# EAGLE design v1.0 (EAGLE 9.2.1)

## Sheet 1 of 8: Switch State and Buttons
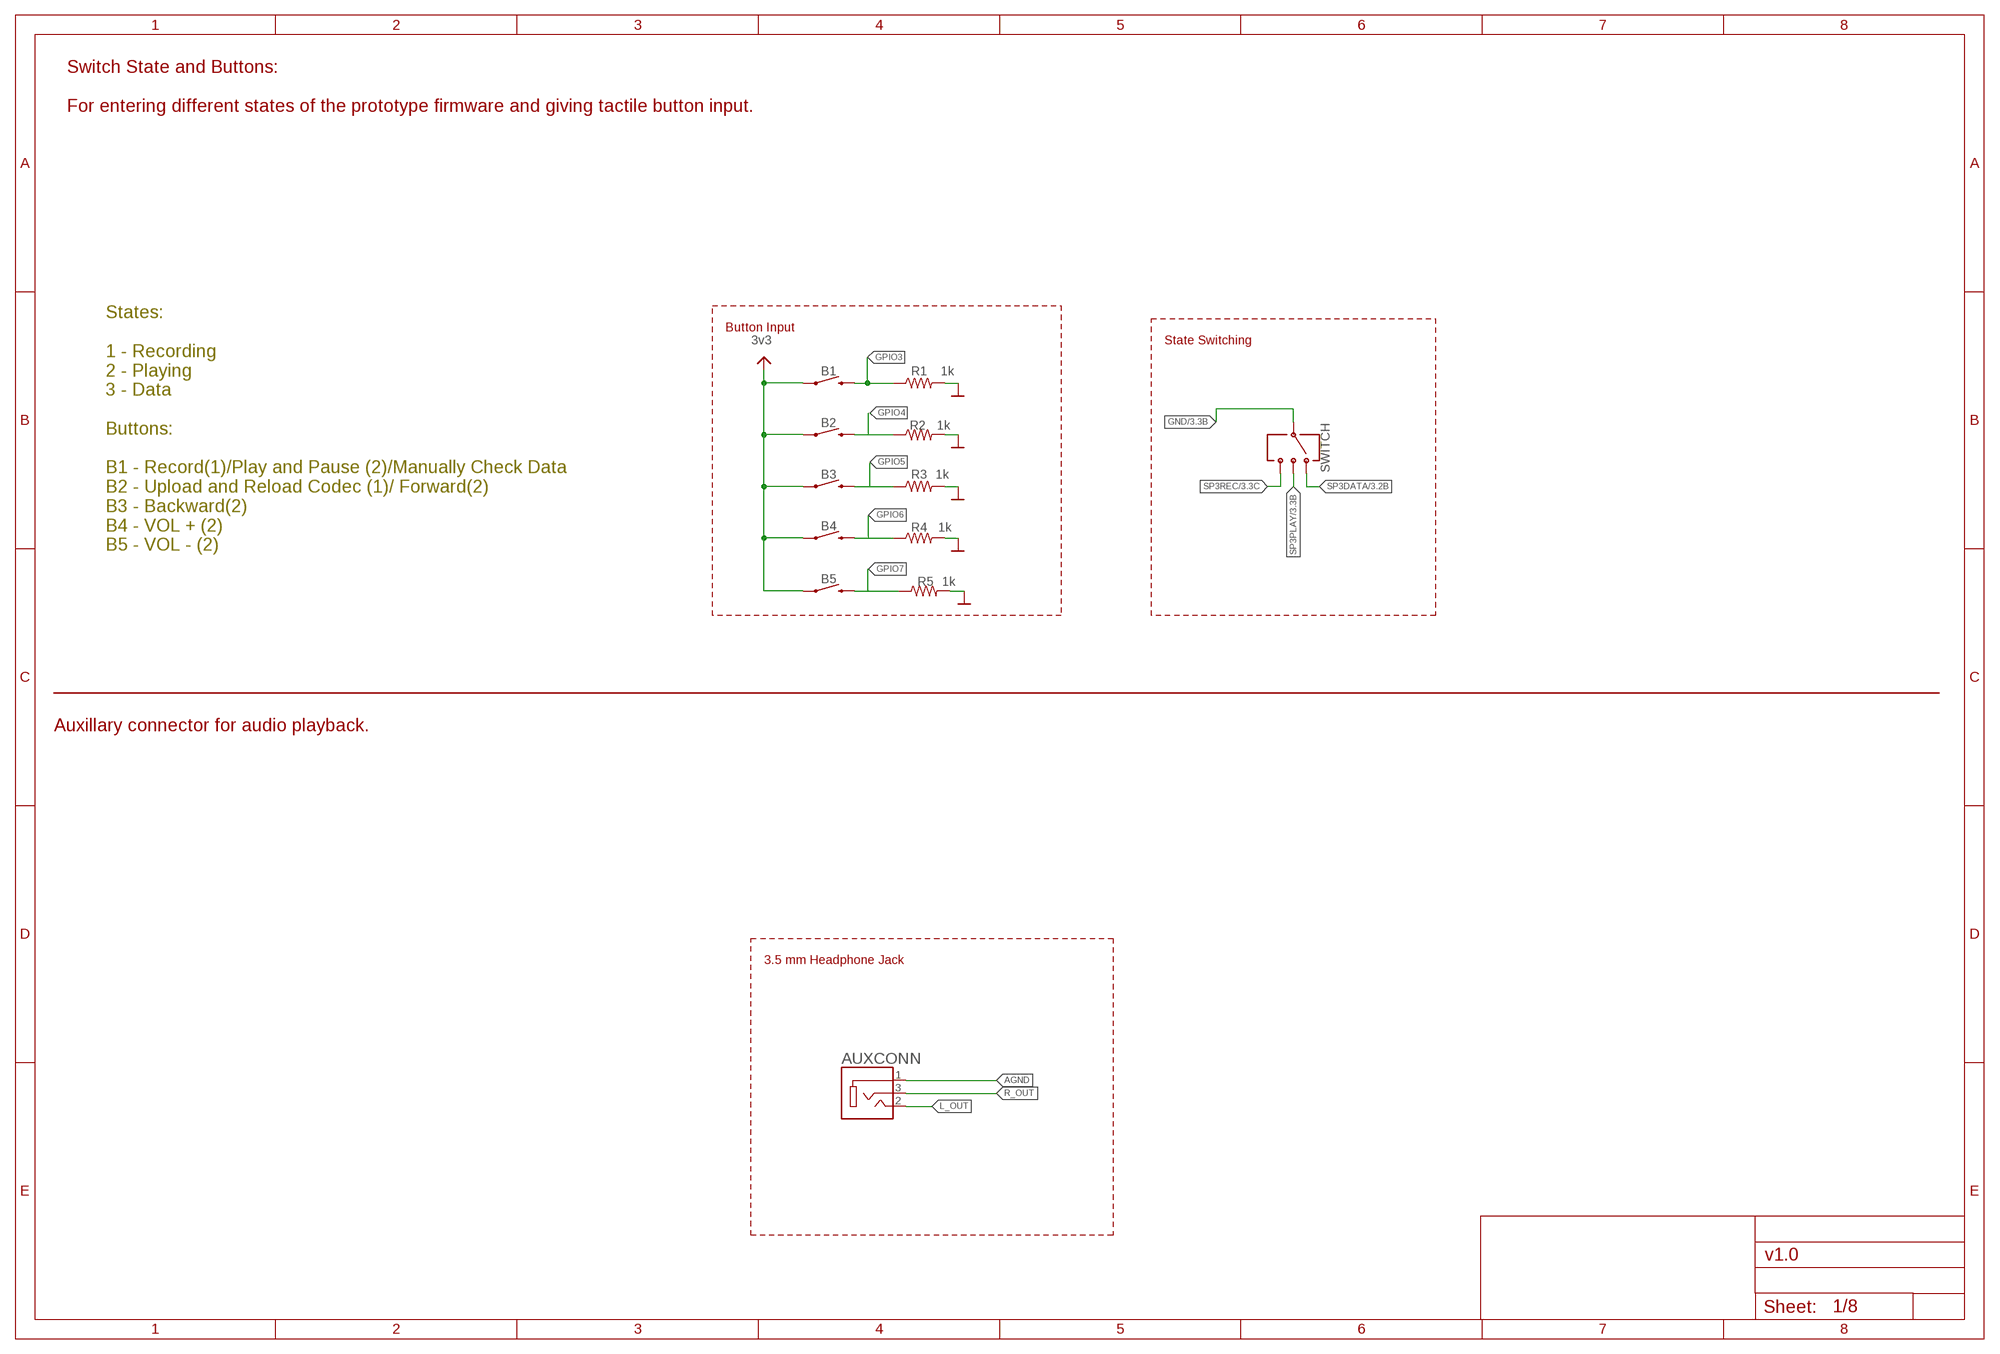
[diagram p0: schematic, sheet 1]

### Parts
AUXCONN  3.5MM_AUX_JACK  [!_SJ-3523-SMT-TR_CUI_SJ-3523-SMT-TR]
B1  MOMENTARY-SWITCH-SPST-SMD-6.2MM-TALL  [!_TACTILE_SWITCH_SMD_6.2MM_TALL]
B2  MOMENTARY-SWITCH-SPST-SMD-6.2MM-TALL  [!_TACTILE_SWITCH_SMD_6.2MM_TALL]
B3  MOMENTARY-SWITCH-SPST-SMD-6.2MM-TALL  [!_TACTILE_SWITCH_SMD_6.2MM_TALL]
B4  MOMENTARY-SWITCH-SPST-SMD-6.2MM-TALL  [!_TACTILE_SWITCH_SMD_6.2MM_TALL]
B5  MOMENTARY-SWITCH-SPST-SMD-6.2MM-TALL  [!_TACTILE_SWITCH_SMD_6.2MM_TALL]
R1  1k  RESISTOR0603  [!_0603]
R2  1k  RESISTOR0603  [!_0603]
R3  1k  RESISTOR0603  [!_0603]
R4  1k  RESISTOR0603  [!_0603]
R5  1k  RESISTOR0603  [!_0603]
SWITCH  SWITCH-SP3T-SMD  [!SWITCH_SP3T_SMD]

### Nets
3.3V: B1.A2 B2.A2 B3.A2 B4.A2 B5.A2 ; supply symbol labelled MICROBUILDER_3.3V ; also sheet 2,3,5,6,7,8
AGND: AUXCONN.1 ; also sheet 2
GND: R1.2 R2.2 R3.2 R4.2 R5.2 SWITCH.3 ; supply symbol labelled MICROBUILDER_GND ; also sheet 2,3,4,5,7,8
GPIO3: B1.B2 R1.1 ; also sheet 2
GPIO4: B2.B2 R2.1 ; also sheet 2
GPIO5: B3.B2 R3.1 ; also sheet 2
GPIO6: B4.B2 R4.1 ; also sheet 2
GPIO7: B5.B2 R5.1 ; also sheet 2
L_OUT: AUXCONN.2 ; also sheet 2
R_OUT: AUXCONN.3 ; also sheet 2
SP3DATA: SWITCH.1 ; also sheet 3
SP3PLAY: SWITCH.2 ; also sheet 3
SP3REC: SWITCH.4 ; also sheet 3

### Notes on the sheet
- Switch State and Buttons: 
  
  For entering different states of the prototype firmware and giving tactile button input.
- Button Input
- 3v3 | State Switching
- States:
  
  1 - Recording
  2 - Playing
  3 - Data
  
  Buttons:
  
  B1 - Record(1)/Play and Pause (2)/Manually Check Data
  B2 - Upload and Reload Codec (1)/ Forward(2)
  B3 - Backward(2)
  B4 - VOL + (2)
  B5 - VOL - (2)
- Auxillary connector for audio playback.
- 3.5 mm Headphone Jack

## Sheet 2 of 8: VS1053 Breakout
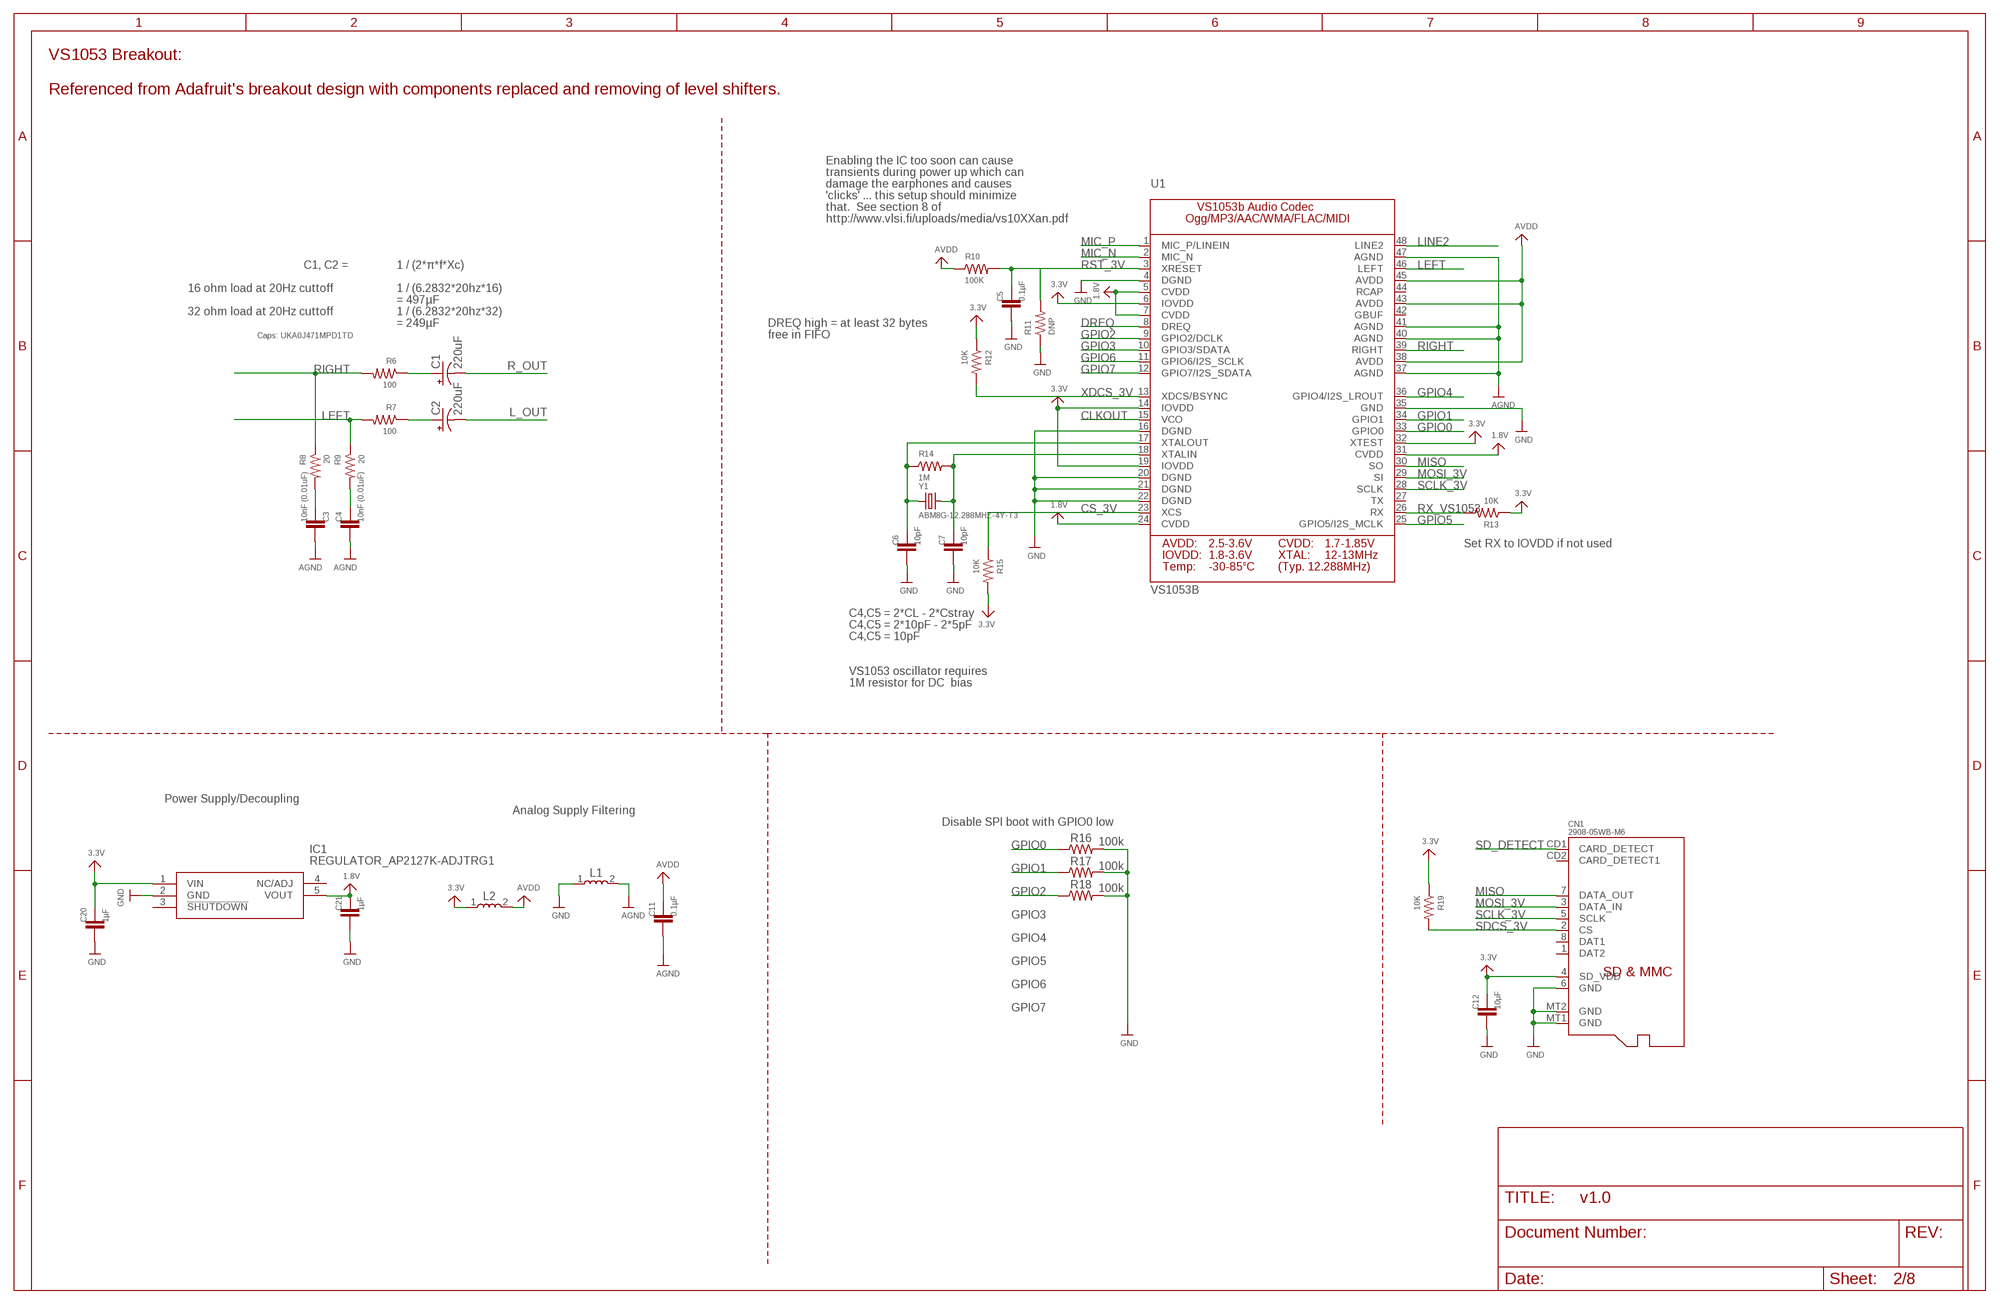
[diagram p1: schematic, sheet 2]

### Parts
C1  220uF  PANASONIC_CAPACITORE  [!_PANASONIC_E]
C2  220uF  PANASONIC_CAPACITORE  [!_PANASONIC_E]
C3  10nF (0.01uF)  CAPACITOR0603  [!_0603]
C4  10nF (0.01uF)  CAPACITOR0603  [!_0603]
C5  0.1µF  CAPACITOR0603  [!_0603]
C6  10pF  CAPACITOR0603  [!_0603]
C7  10pF  CAPACITOR0603  [!_0603]
C11  0.1µF  CAPACITOR0603  [!_0603]
C12  10µF  CAPACITOR0603  [!_0603]
C20  1µF  CAPACITOR0603  [!_0603]
C21  1µF  CAPACITOR0603  [!_0603]
CN1  2908-05WB-M6  MICROSD_SPI  [!_MICROSD]
IC1  REGULATOR_AP2127K-ADJTRG1  [!_AP2127K-ADJTRG1_SOT95P282X145-5N]
L1  FERRITE_BEAD0805  [!_FERRITE_0805]
L2  FERRITE_BEAD0805  [!_FERRITE_0805]
R6  100  RESISTOR0603  [!_0603]
R7  100  RESISTOR0603  [!_0603]
R8  20  RESISTOR0603  [!_0603]
R9  20  RESISTOR0603  [!_0603]
R10  100K  RESISTOR0603  [!_0603]
R11  DNP  RESISTOR0603  [!_0603]
R12  10K  RESISTOR0603  [!_0603]
R13  10K  RESISTOR0603  [!_0603]
R14  1M  RESISTOR0603  [!_0603]
R15  10K  RESISTOR0603  [!_0603]
R16  100k  RESISTOR0603  [!_0603]
R17  100k  RESISTOR0603  [!_0603]
R18  100k  RESISTOR0603  [!_0603]
R19  10K  RESISTOR0603  [!_0603]
U1  VS1053B  [!VS1053_LQFP48]
Y1  ABM8G-12.288MHZ-4Y-T3  MEMS_SMT_CRYSTAL3.2X2.5  [!_CRYSTAL_3.2X2.5]

### Nets
1.8V: C21.1 IC1.5(VOUT) U1.5(CVDD) U1.7(CVDD) U1.24(CVDD) U1.31(CVDD)
3.3V: C12.1 C20.1 CN1.4(SD_VDD) IC1.1(VIN) L2.1 R12.1 R13.1 R15.2 R19.1 U1.6(IOVDD) U1.14(IOVDD) U1.19(IOVDD) U1.32(XTEST) ; also sheet 1,3,5,6,7,8
AGND: C3.2 C4.2 C11.2 L1.2 U1.37(AGND) U1.40(AGND) U1.41(AGND) U1.47(AGND) ; also sheet 1
AVDD: C11.1 L2.2 R10.1 U1.38(AVDD) U1.43(AVDD) U1.45(AVDD)
CLKOUT: U1.15(VCO)
CS_3V: R15.1 U1.23(XCS) ; also sheet 3
DREQ: U1.8(DREQ) ; also sheet 3
GND: C5.2 C6.2 C7.2 C12.2 C20.2 C21.2 CN1.6(GND) CN1.MT1(GND) CN1.MT2(GND) IC1.2(GND) L1.1 R11.1 R16.2 R17.2 R18.2 U1.4(DGND) U1.16(DGND) U1.20(DGND) U1.21(DGND) U1.22(DGND) U1.35(GND) ; also sheet 1,3,4,5,7,8
GPIO0: R16.1 U1.33(GPIO0)
GPIO1: R17.1 U1.34(GPIO1)
GPIO2: R18.1 U1.9(GPIO2/DCLK)
GPIO3: U1.10(GPIO3/SDATA) ; also sheet 1
GPIO4: U1.36(GPIO4/I2S_LROUT) ; also sheet 1
GPIO5: U1.25(GPIO5/I2S_MCLK) ; also sheet 1
GPIO6: U1.11(GPIO6/I2S_SCLK) ; also sheet 1
GPIO7: U1.12(GPIO7/I2S_SDATA) ; also sheet 1
L_OUT: C2.- ; also sheet 1
LEFT: R7.2 R9.1 U1.46(LEFT)
LEFT_FILTERED: C2.+ R7.1
LINE2: U1.48(LINE2)
MIC_N: U1.2(MIC_N)
MIC_P: U1.1(MIC_P/LINEIN) ; also sheet 7
MISO: CN1.7(DATA_OUT) U1.30(SO) ; also sheet 3,5
MOSI_3V: CN1.3(DATA_IN) U1.29(SI) ; also sheet 3,5
N$1: C6.1 R14.1 U1.17(XTALOUT) Y1.1
N$2: C7.1 R14.2 U1.18(XTALIN) Y1.2
N$5: C4.1 R9.2
N$6: C3.1 R8.2
R_OUT: C1.- ; also sheet 1
RIGHT: R6.2 R8.1 U1.39(RIGHT)
RIGHT_FILTERED: C1.+ R6.1
RST_3V: C5.1 R10.2 R11.2 U1.3(XRESET) ; also sheet 3
RX_VS1053: R13.2 U1.26(RX)
SCLK_3V: CN1.5(SCLK) U1.28(SCLK) ; also sheet 3,5
SD_DETECT: CN1.CD1(CARD_DETECT)
SDCS_3V: CN1.2(CS) R19.2 ; also sheet 3
XDCS_3V: R12.2 U1.13(XDCS/BSYNC) ; also sheet 3
Unconnected: CN1.1(DAT2) CN1.8(DAT1) CN1.CD2(CARD_DETECT1) IC1.3(!SHUTDOWN) IC1.4(NC/ADJ) U1.27(TX) U1.42(GBUF) U1.44(RCAP)

### Notes on the sheet
- VS1053 Breakout:
  
  Referenced from Adafruit's breakout design with components replaced and removing of level shifters.
- Enabling the IC too soon can cause
- transients during power up which can
- damage the earphones and causes
- 'clicks' ... this setup should minimize
- that.  See section 8 of
- http://www.vlsi.fi/uploads/media/vs10XXan.pdf
- C1, C2 = | 1 / (2*π*f*Xc)
- 16 ohm load at 20Hz cuttoff | 1 / (6.2832*20hz*16)
- = 497µF
- 32 ohm load at 20Hz cuttoff | 1 / (6.2832*20hz*32)
- = 249µF | DREQ high = at least 32 bytes
- Caps: UKA0J471MPD1TD | free in FIFO
- Set RX to IOVDD if not used
- C4,C5 = 2*CL - 2*Cstray
- C4,C5 = 2*10pF - 2*5pF
- C4,C5 = 10pF
- VS1053 oscillator requires
- 1M resistor for DC  bias
- Power Supply/Decoupling
- Analog Supply Filtering
- Disable SPI boot with GPIO0 low

## Sheet 3 of 8: Photon Breakout
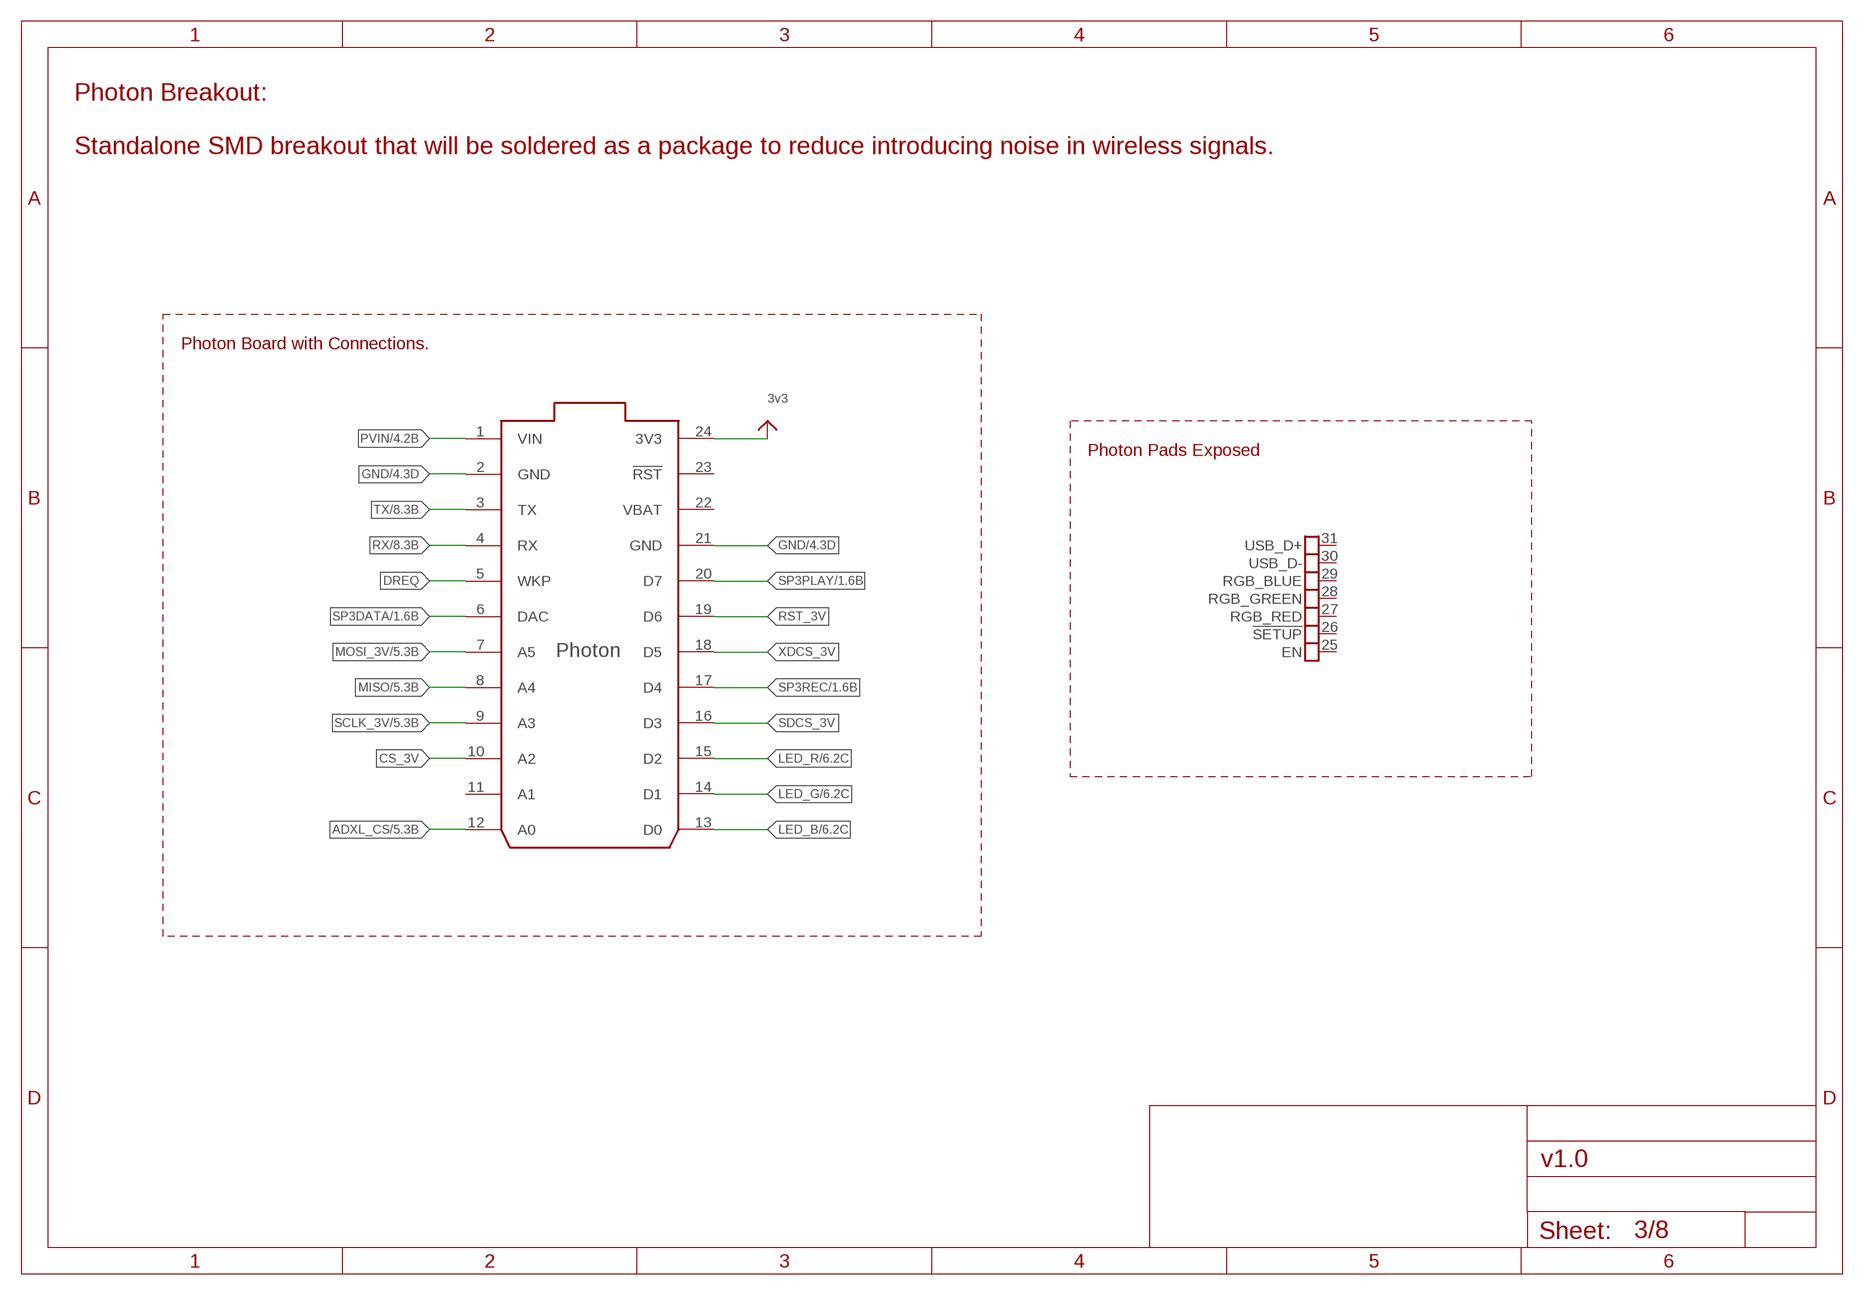
[diagram p2: schematic, sheet 3]

### Parts
U$1  PARTICLE-DEVICES_PHOTON_SMD  [!_PARTICLE-DEVICES_PHOTON_SMD]

### Nets
3.3V: U$1.24(3V3) ; supply symbol labelled MICROBUILDER_3.3V ; also sheet 1,2,5,6,7,8
ADXL_CS: U$1.12(A0) ; also sheet 5
CS_3V: U$1.10(A2) ; also sheet 2
DREQ: U$1.5(WKP) ; also sheet 2
GND: U$1.2(GND) U$1.21(GND) ; also sheet 1,2,4,5,7,8
LED_B: U$1.13(D0) ; also sheet 6
LED_G: U$1.14(D1) ; also sheet 6
LED_R: U$1.15(D2) ; also sheet 6
MISO: U$1.8(A4) ; also sheet 2,5
MOSI_3V: U$1.7(A5) ; also sheet 2,5
PVIN: U$1.1(VIN) ; also sheet 4
RST_3V: U$1.19(D6) ; also sheet 2
RX: U$1.4(RX) ; also sheet 8
SCLK_3V: U$1.9(A3) ; also sheet 2,5
SDCS_3V: U$1.16(D3) ; also sheet 2
SP3DATA: U$1.6(DAC) ; also sheet 1
SP3PLAY: U$1.20(D7) ; also sheet 1
SP3REC: U$1.17(D4) ; also sheet 1
TX: U$1.3(TX) ; also sheet 8
XDCS_3V: U$1.18(D5) ; also sheet 2
Unconnected: U$1.11(A1) U$1.23(!RST) U$1.25(EN) U$1.26(!SETUP) U$1.27(RGB_RED) U$1.28(RGB_GREEN) U$1.29(RGB_BLUE) U$1.30(USB_D-) U$1.31(USB_D+)

### Notes on the sheet
- Photon Breakout:
  
  Standalone SMD breakout that will be soldered as a package to reduce introducing noise in wireless signals.
- Photon Board with Connections.
- 3v3
- Photon Pads Exposed

## Sheet 4 of 8: Power Management
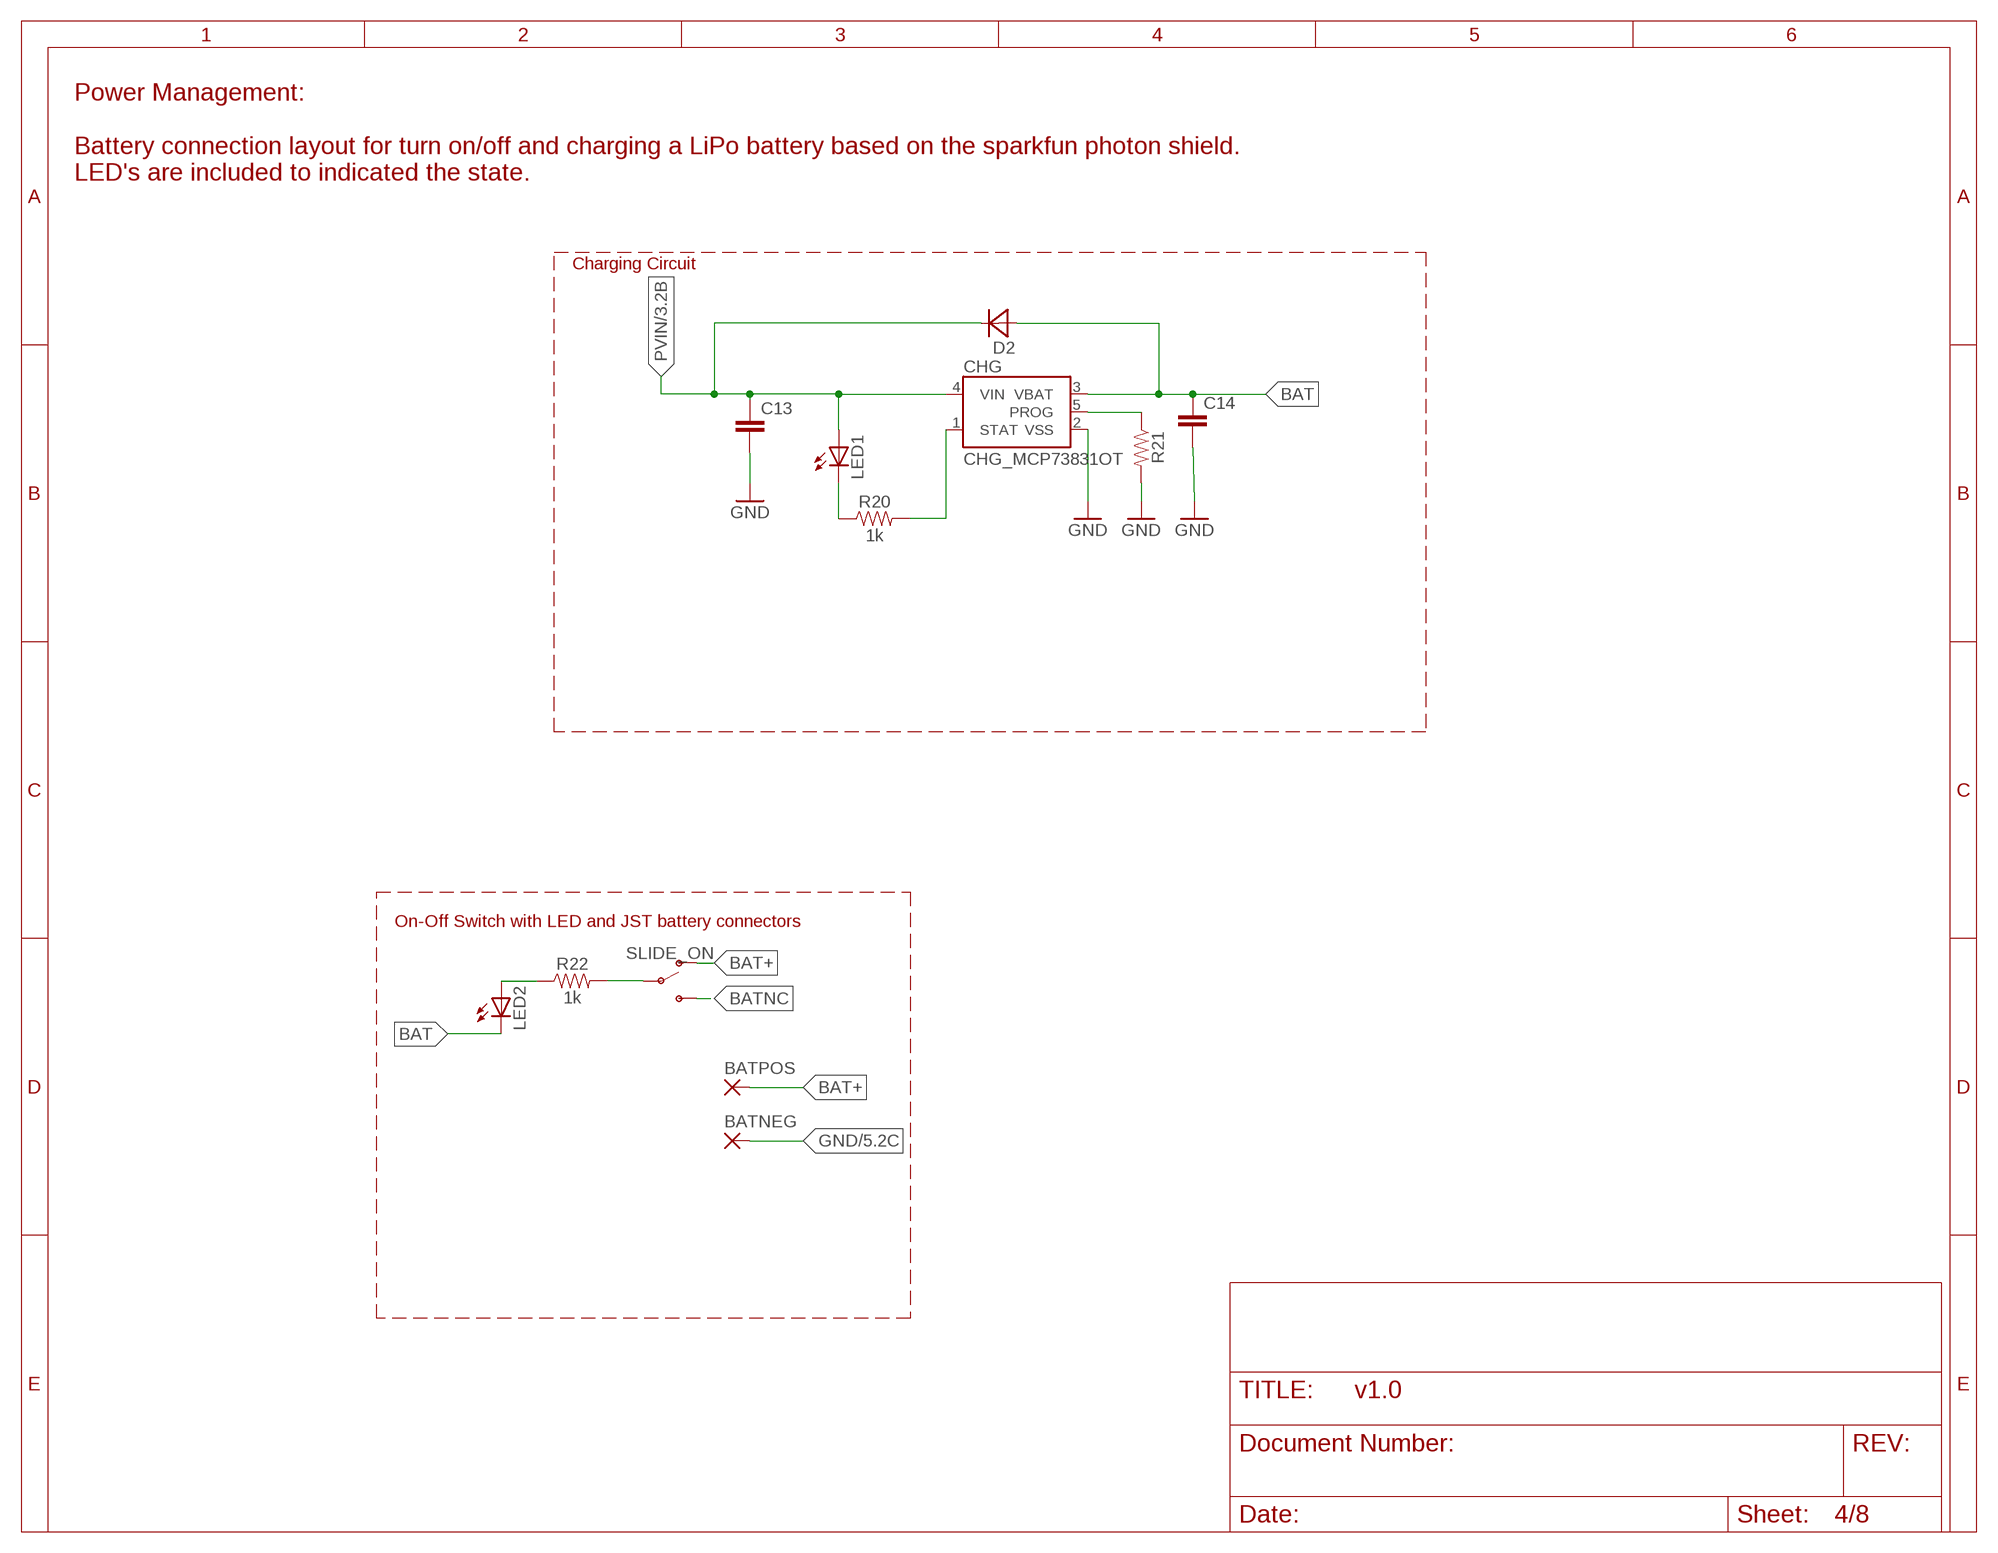
[diagram p3: schematic, sheet 4]

### Parts
BATNEG  SMD5  [SMD2,54-5,08]
BATPOS  SMD5  [SMD2,54-5,08]
C13  4.7uF  CAPACITOR0603  [!_0603]
C14  4.7uF  CAPACITOR0603  [!_0603]
CHG  CHG_MCP73831OT  [!_SOT23-5]
D2  DIODE_MBRA140T3  [!_DIODE_SMA]
LED1  PASSIVE_LED  [!_LED_0603]
LED2  PASSIVE_LED  [!_LED_0603]
R20  1k  RESISTOR0603  [!_0603]
R21  10k  RESISTOR0603  [!_0603]
R22  1k  RESISTOR0603  [!_0603]
SLIDE_ON  PASSIVE_SLIDE_SWITCHES  [!_SWITCH_PCM12SMTR]

### Nets
BAT: C14.1 CHG.3(VBAT) D2.A LED2.C
BAT+: BATPOS.1(P) SLIDE_ON.O
BATNC: SLIDE_ON.S
GND: BATNEG.1(P) C13.2 C14.2 CHG.2(VSS) R21.2 ; also sheet 1,2,3,5,7,8
N$3: CHG.1(STAT) R20.2
N$4: LED1.C R20.1
N$8: R22.2 SLIDE_ON.P
N$9: LED2.A R22.1
N$21: CHG.5(PROG) R21.1
PVIN: C13.1 CHG.4(VIN) D2.C LED1.A ; also sheet 3

### Notes on the sheet
- Power Management:
  
  Battery connection layout for turn on/off and charging a LiPo battery based on the sparkfun photon shield. 
  LED's are included to indicated the state.
- Charging Circuit
- On-Off Switch with LED and JST battery connectors

## Sheet 5 of 8: Accelerometer ADXL335
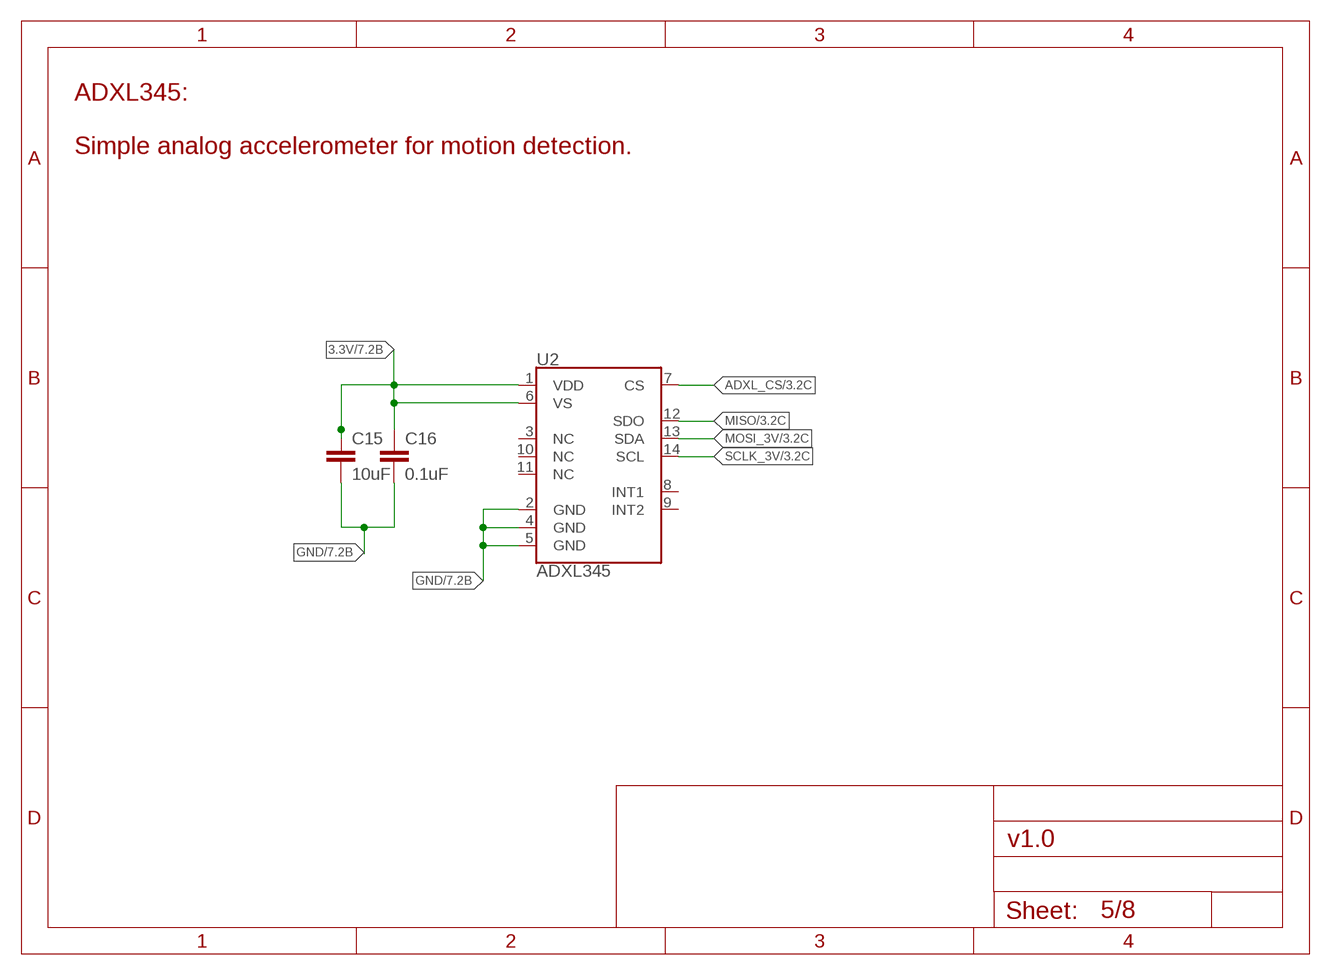
[diagram p4: schematic, sheet 5]

### Parts
C15  10uF  CAPACITOR0603  [!_0603]
C16  0.1uF  CAPACITOR0603  [!_0603]
U2  ADXL345  [!_ADXL345_LGA-14]

### Nets
3.3V: C15.1 C16.1 U2.1(VDD) U2.6(VS) ; also sheet 1,2,3,6,7,8
ADXL_CS: U2.7(CS) ; also sheet 3
GND: C15.2 C16.2 U2.2(GND) U2.4(GND) U2.5(GND) ; also sheet 1,2,3,4,7,8
MISO: U2.12(SDO) ; also sheet 2,3
MOSI_3V: U2.13(SDA) ; also sheet 2,3
SCLK_3V: U2.14(SCL) ; also sheet 2,3
Unconnected: U2.3(NC) U2.8(INT1) U2.9(INT2) U2.10(NC) U2.11(NC)

### Notes on the sheet
- ADXL345:
  
  Simple analog accelerometer for motion detection.

## Sheet 6 of 8: Tricolour-LED
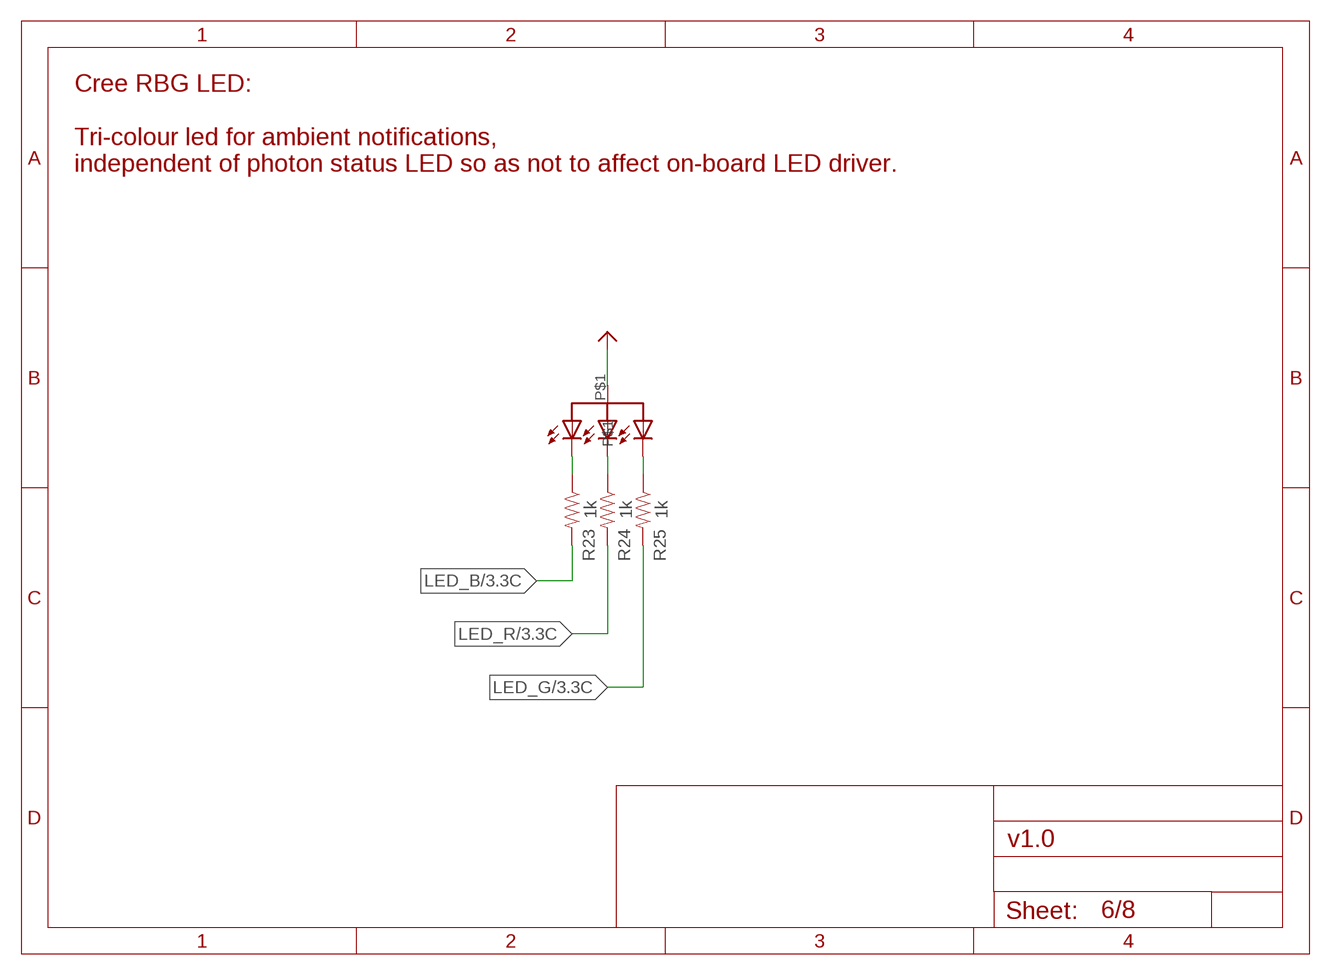
[diagram p5: schematic, sheet 6]

### Parts
LED3  LED_TRICOLOR_3.2X2.8  [!_LED_3.2X2.8]
R23  1k  RESISTOR0603  [!_0603]
R24  1k  RESISTOR0603  [!_0603]
R25  1k  RESISTOR0603  [!_0603]

### Nets
3.3V: LED3.P$1 ; supply symbol labelled MICROBUILDER_3.3V ; also sheet 1,2,3,5,7,8
LED_B: R23.2 ; also sheet 3
LED_G: R25.2 ; also sheet 3
LED_R: R24.2 ; also sheet 3
N$11: LED3.P$2 R23.1
N$12: LED3.P$3 R24.1
N$13: LED3.P$4 R25.1

### Notes on the sheet
- Cree RBG LED:
  
  Tri-colour led for ambient notifications, 
  independent of photon status LED so as not to affect on-board LED driver.

## Sheet 7 of 8: Microphone Breakout
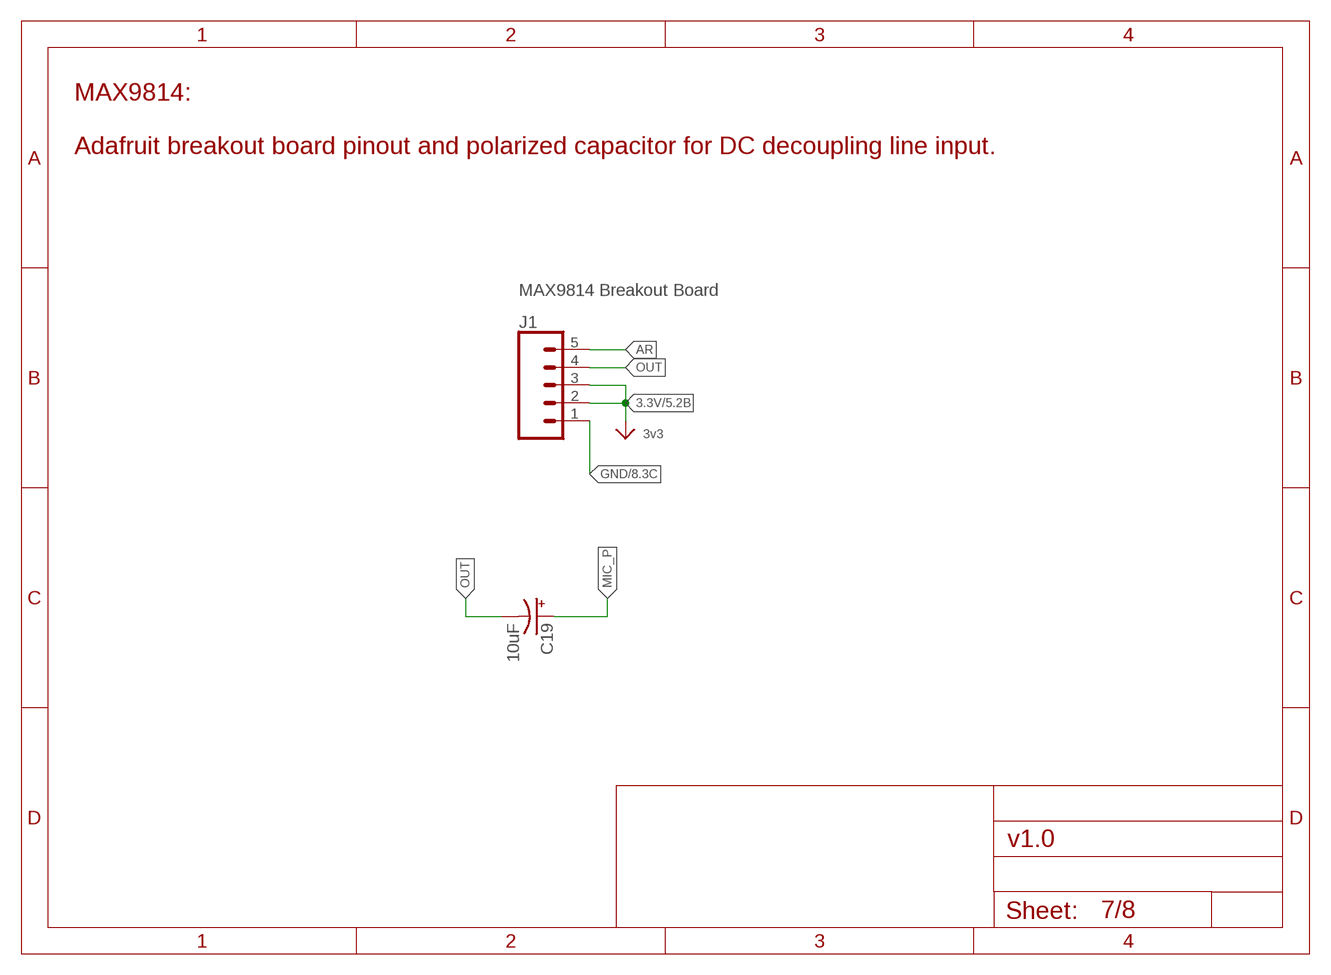
[diagram p6: schematic, sheet 7]

### Parts
C19  10uF  PARTICLE_TANT-CAP0603  [!_PARTICLE_PC0603]
J1  CONNECTORS_CONN_05  [!_CONNECTORS_1X05]

### Nets
3.3V: J1.2 J1.3 ; supply symbol labelled MICROBUILDER_3.3V ; also sheet 1,2,3,5,6,8
AR: J1.5
GND: J1.1 ; also sheet 1,2,3,4,5,8
MIC_P: C19.A(+) ; also sheet 2
OUT: C19.C(-) J1.4

### Notes on the sheet
- MAX9814:
  
  Adafruit breakout board pinout and polarized capacitor for DC decoupling line input.
- MAX9814 Breakout Board
- 3v3

## Sheet 8 of 8: GPS Breakout
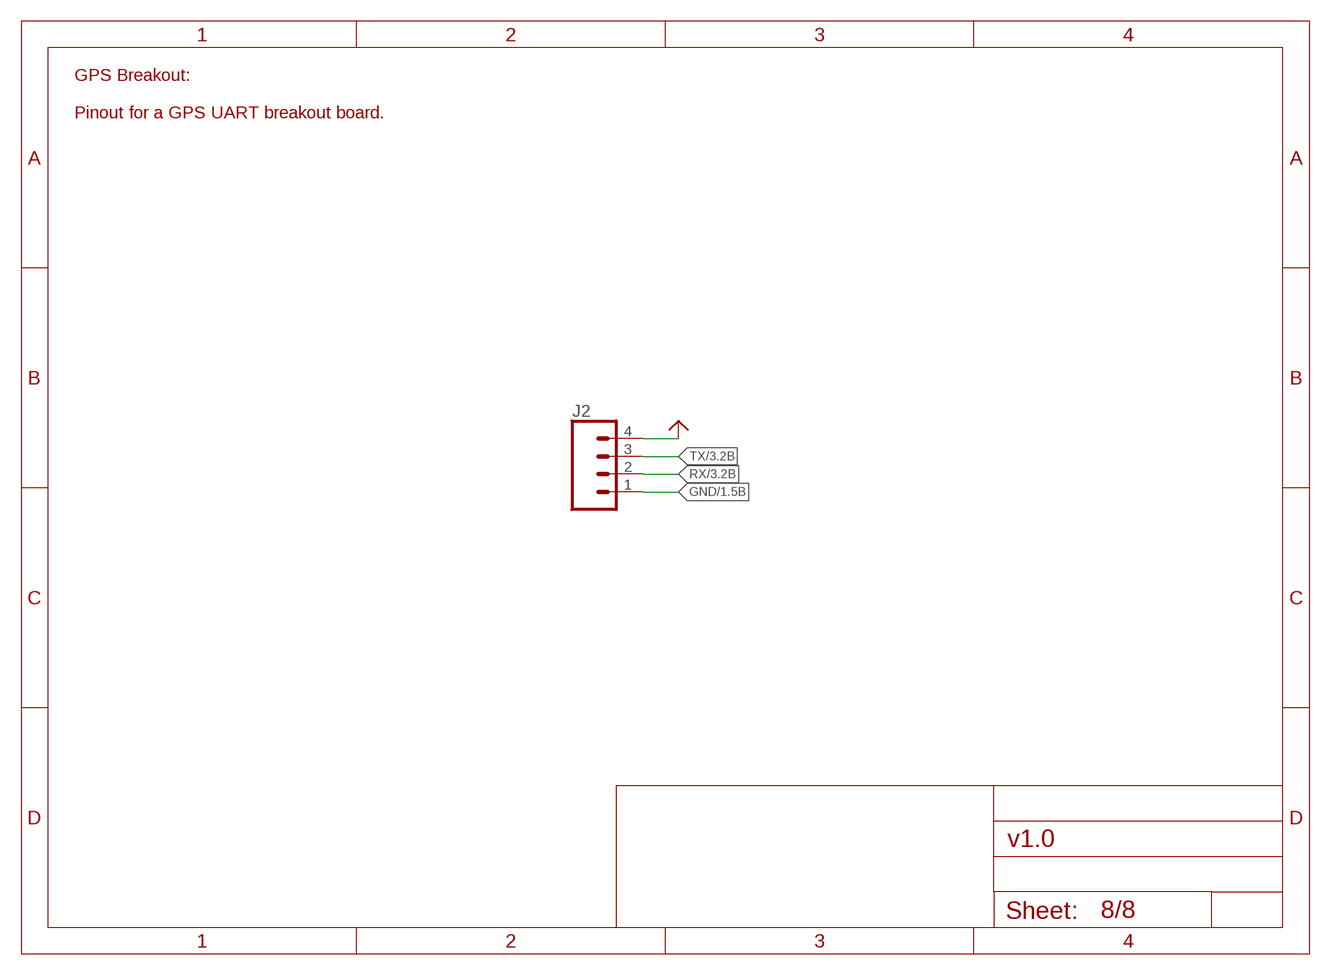
[diagram p7: schematic, sheet 8]

### Parts
J2  CONNECTORS_CONN_04  [!_CONNECTORS_1X04]

### Nets
3.3V: J2.4 ; supply symbol labelled MICROBUILDER_3.3V ; also sheet 1,2,3,5,6,7
GND: J2.1 ; also sheet 1,2,3,4,5,7
RX: J2.2 ; also sheet 3
TX: J2.3 ; also sheet 3

### Notes on the sheet
- GPS Breakout:
  
  Pinout for a GPS UART breakout board.

## Power pins joined to a net without a drawn wire
VBAT: U$1.22(VBAT)

## Library data of the parts
AUXCONN = clab_v1.0:3.5MM_AUX_JACK: Audio Jack Connector 3.5 mm Low Profile Surface Mount Stereo Jack, 3 Pin Right-Angle; AVAILABILITY: Unavailable; CUI_PURCHASE_URL: https://www.cui.com/product/interconnect/audio-connectors/3.5-mm-jacks/sj-352x-smt-series?utm_source=snapeda.com&utm_medium=referral&utm_campaign=snapedaBOM; DESCRIPTION: SJ Series 3.5 mm 12 V SMT Right Angle Stereo Audio Jack; MF: CUI Inc.; MP: SJ-3523-SMT-TR; PACKAGE: LGA-10 STMicroelectronics; PRICE: None
B1-B5 = clab_v1.0:MOMENTARY-SWITCH-SPST: Momentary Switch (Pushbutton) - SPST Normally-open (NO) SPST momentary switches (buttons, pushbuttons). Variants PTH-12MM - 12mm square, through-hole Momentary Pushbutton Switch - 12mm Square <https://www.sparkfun.com/products/9190> (COM-09190) PTH-6.0MM, PTH-6.0MM-KIT - 6.0mm square, through-hole Mini Pushbutton Switch <https://www.sparkfun.com/products/97> (COM-00097) KIT package intended for soldering kit's - only one side of pads' copper is exposed. PTH-RIGHT-ANGLE-KIT - Right-angle, through-hole Right Angle Tactile Button <https://www.sparkfun.com/products/10791> - Used on SparkFun BigTime Watch Kit <https://www.sparkfun.com/products/11734> SMD-12MM - 12mm square, surface-mount Tactile Button - SMD (12mm) <https://www.sparkfun.com/products/12993> (COM-12993) Used on SparkFun PicoBoard <https://www.sparkfun.com/products/11888> SMD-4.5MM - 4.5mm Square Trackball Switch Used on SparkFun Blackberry Trackballer Breakout <https://www.sparkfun.com/products/13169> SMD-4.6MMX2.8MM - 4.60mm x 2.80mm, surface mount Used on SparkFun SAMD21 Mini Breakout <https://www.sparkfun.com/products/13664> SMD-5.2MM, SMD-5.2-REDUNDANT - 5.2mm square, surface-mount Mini Pushbutton Switch - SMD <https://www.sparkfun.com/products/8720> (COM-08720) Used on Arduino Pro Mini <https://www.sparkfun.com/products/11114> REDUNDANT package connects both switch circuits together SMD-6.0X3.5MM - 6.0 x 3.5mm, surface mount Momentary Reset Switch SMD <https://www.sparkfun.com/products/8229> (COM-08229) SMD-6.2MM-TALL - 6.2mm square, surface mount Tactile Button - SMD (6mm) <https://www.sparkfun.com/products/12992> Used on SparkFun Digital Sandbox <https://www.sparkfun.com/products/12651> SMD-RIGHT-ANGLE - Right-angle, surface mount Used on SparkFun Block for Intel® Edison - Arduino <https://www.sparkfun.com/products/13036>; PROD_ID: SWCH-11966; SF_SKU: COM-12992
BATNEG BATPOS = wirepad:SMD5: SMD PAD
C1 C2 = clab_v1.0:PANASONIC_CAPACITOR: POLARIZED CAPACITOR, American symbol; SPICEPREFIX: C
C3-C7 C11-C16 C20 C21 = clab_v1.0:CAPACITOR
C19 = clab_v1.0:PARTICLE_TANT-CAP: Tantalum SMT
CHG = clab_v1.0:CHG_MCP73831; DIGIKEY: MCP73831T-2ATI/OTCT-ND
CN1 = clab_v1.0:MICROSD_SPI: MicroSD/Transflash Card Holder with SPI pinout 3M: 2908-05WB-MG 4UConnector: 19656 Footprint courtesy: Adafruit Industries
D2 = clab_v1.0:DIODE_MBRA140T3: Surface Mount Schottky Power Rectifier Source: http://www.onsemi.com/pub_link/Collateral/MBRA340T3-D.PDF
IC1 = clab_v1.0:REGULATOR_AP2127K-ADJTRG1: DiodesZetex AP2127K-ADJTRG1, Low Noise LDO Voltage Regulator, Adjustable 0.8 5.5 V +/-2%, 5-Pin SOT-23 Source: Datasheet <https://www.diodes.com/assets/Datasheets/AP2127.pdf>; ALLIED_NUMBER: 70550999; ALLIED_PRICE-STOCK: https://www.alliedelec.com/diodesinc-ap2127k-adjtrg1/70550999/; DESCRIPTION: DiodesZetex AP2127K-ADJTRG1, Low Noise LDO Voltage Regulator, Adjustable 0.8 5.5 V +/-2%, 5-Pin SOT-23; HEIGHT: 1.45mm; MANUFACTURER_NAME: Diodes Inc.; MANUFACTURER_PART_NUMBER: AP2127K-ADJTRG1; MOUSER_PART_NUMBER: 621-AP2127K-ADJTRG1; MOUSER_PRICE-STOCK: https://www.mouser.com/Search/Refine.aspx?Keyword=621-AP2127K-ADJTRG1; RS_PART_NUMBER: 9210382P; RS_PRICE-STOCK: http://uk.rs-online.com/web/p/products/9210382P
J1 = clab_v1.0:CONNECTORS_CONN_05: Multi connection point. Often used as Generic Header-pin footprint for 0.1 inch spaced/style header connections On any of the 0.1 inch spaced packages, you can populate with these: Break Away Headers - Straight <https://www.sparkfun.com/products/116> (PRT-00116) Break Away Male Headers - Right Angle <https://www.sparkfun.com/products/553> (PRT-00553) Female Headers <https://www.sparkfun.com/products/115> (PRT-00115) Break Away Headers - Machine Pin <https://www.sparkfun.com/products/117> (PRT-00117) Break Away Female Headers - Swiss Machine Pin <https://www.sparkfun.com/products/743> (PRT-00743) For SCREWTERMINALS and SPRING TERMINALS visit here: Screw Terimnals on SparkFun.com <https://www.sparkfun.com/search/results?term=Screw+Terminals> (5mm/3.5mm/2.54mm spacing) This device is also useful as a general connection point to wire up your design to another part of your project. Our various solder wires solder well into these plated through hole pads. Hook-Up Wire - Assortment (Stranded, 22 AWG) <https://www.sparkfun.com/products/11375> (PRT-11375) Hook-Up Wire - Assortment (Solid Core, 22 AWG) <https://www.sparkfun.com/products/11367> (PRT-11367) View the entire wire category on our website here <https://www.sparkfun.com/categories/141> Special notes: Molex polarized connector foot print use with SKU : PRT-08231 with associated crimp pins and housings. 1MM SMD Version SKU: PRT-10208
J2 = clab_v1.0:CONNECTORS_CONN_04: Multi connection point. Often used as Generic Header-pin footprint for 0.1 inch spaced/style header connections On any of the 0.1 inch spaced packages, you can populate with these: Break Away Headers - Straight <https://www.sparkfun.com/products/116> (PRT-00116) Break Away Male Headers - Right Angle <https://www.sparkfun.com/products/553> (PRT-00553) Female Headers <https://www.sparkfun.com/products/115> (PRT-00115) Break Away Headers - Machine Pin <https://www.sparkfun.com/products/117> (PRT-00117) Break Away Female Headers - Swiss Machine Pin <https://www.sparkfun.com/products/743> (PRT-00743) For SCREWTERMINALS and SPRING TERMINALS visit here: Screw Terimnals on SparkFun.com <https://www.sparkfun.com/search/results?term=Screw+Terminals> (5mm/3.5mm/2.54mm spacing) This device is also useful as a general connection point to wire up your design to another part of your project. Our various solder wires solder well into these plated through hole pads. Hook-Up Wire - Assortment (Stranded, 22 AWG) <https://www.sparkfun.com/products/11375> (PRT-11375) Hook-Up Wire - Assortment (Solid Core, 22 AWG) <https://www.sparkfun.com/products/11367> (PRT-11367) View the entire wire category on our website here <https://www.sparkfun.com/categories/141> Special notes: Molex polarized connector foot print use with SKU : PRT-08231 with associated crimp pins and housings. 1MM SMD Version SKU: PRT-10208; PROD_ID: CONN-09696
L1 L2 = clab_v1.0:FERRITE_BEAD
LED1 LED2 = clab_v1.0:PASSIVE_LED
LED3 = clab_v1.0:LED_TRICOLOR; DIGIKEY: CLV1L-FKB-CHMMQEHBB7673673CT-ND
R1-R25 = clab_v1.0:RESISTOR
SLIDE_ON = clab_v1.0:PASSIVE_SLIDE_SWITCHES
SWITCH = clab_v1.0:SWITCH-SP3T: Single-Pole, Triple-Throw (SP3T) Switch Single-Pole, Triple-Throw switches SparkFun Products Prototype Part; PROD_ID: SWCH-10805
U1 = clab_v1.0:VS1053B: VS1053b Audio Codec - Ogg Vorbis/MP3/AAC/WMA/FLAC/MIDI
U2 = clab_v1.0:ADXL345: Analog Devices ADXL345 3-Axis SPI/I2C 2/4/8/16g Accelerometer The ADXL345 is a small, thin, low power, 3-axis accelerometer with high resolution (13-bit) measurement at up to ±16g. Digital output data is formatted as 16-bit twos complement and is accessible through either a SPI (3- or 4-wire) or I2C digital interface. Datasheet <https://www.sparkfun.com/datasheets/Sensors/Accelerometer/ADXL345.pdf> SparkFun Products SparkFun Triple Axis Accelerometer Breakout - ADXL345 <https://www.sparkfun.com/products/9836> (SEN-09836) Triple Axis Accelerometer - ADXL345 <https://www.sparkfun.com/products/9045> (SEN-09045) SparkFun 6 Degrees of Freedom IMU Digital Combo Board - ITG3200/ADXL345 <https://www.sparkfun.com/products/10121> (SEN-10121); DESCRIPTION: ADI Digital Output Three-Axis Accel; MF: Analog Devices; MP: ADXL345; PACKAGE: None
U$1 = clab_v1.0:PARTICLE-DEVICES_PHOTON_SMD: Particle Photon (without headers) WiFi development board footprint - designed to be surface mounted with 7 extra exposed pads on the bottom of the board which include, 3 RGB LED outputs, /SETUP, EN (3.3V SMPS enable input), USB D+ and USB D-. Product datasheet: here <https://docs.particle.io/datasheets/photon-(wifi)/photon-datasheet/> Design files: here <https://github.com/particle-iot/photon> Github : Particle devices library <https://github.com/particle-iot/hardware-libraries/tree/master/Eagle>
Y1 = clab_v1.0:MEMS_SMT_CRYSTAL: Crystals HC49UP - Surface Mount Crystal 4.0MHz 18pF +/-30ppm Surface Mount Crystal [Digikey: 535-9857-1-ND] 12.0 MHz Surface Mount Crystal [Digikey: 535-9869-6-ND] 25.0 MHz Surface Mount Crystal [Digikey: 535-9078-1-ND] 2.5 x 2.0mm - MEMs SMT Crystal 16.0 MHz 10pF 20ppm 2.5 x 2.0mm Crystal [Digikey -40-85°C: 535-10923-1-ND] 3.2 x 2.5mm - MEMs SMT Crystal 12.0 MHz 8pF 15ppm 3.2 x 2.5mm Crystal [Digikey: -10-70°C: 644-1047-1-ND -40-125°C: 644-1128-1-ND] 40~85°C cheaper: 644-1173-6-ND 16.0 MHz 8pF 15ppm 3.2 x 2.5mm Crystal [Digikey: -10-70°C: 644-1049-1-ND -40-125°C: 644-1129-2-ND]-40~85°C cheaper: 644-1175-6-ND 16.0 MHz 10pF 10ppm 3.2 x 2.5mm Crystal [Digikey: 644-1100-1-ND] 27.12 MHz 18pF 30ppm 3.2 x 2.5mm Crystal [Digikey: 887-1424-1-ND] 27.12MHz 10pF 10ppm 3.2 x 2.5mm Crystal [Digikey: 887-1329-1-ND] 4.9 x 1.8mm - MEMs SMT Crystal 32.768 KHz 12.5pF 20ppm 4.9 x 1.8mm Crystal [Digikey: SE2415CT-ND] 8.0 x 3.8mm - Surface Mount Crystal 32.768kHz 12.5pF 20ppm -40°C-85°C [Digikey: 535-9166-2-ND] Cylinder 32.768KHz Cylinder Crystal (2x6mm body) [Ex. Digikey: 300-8341-2-ND]

## Board
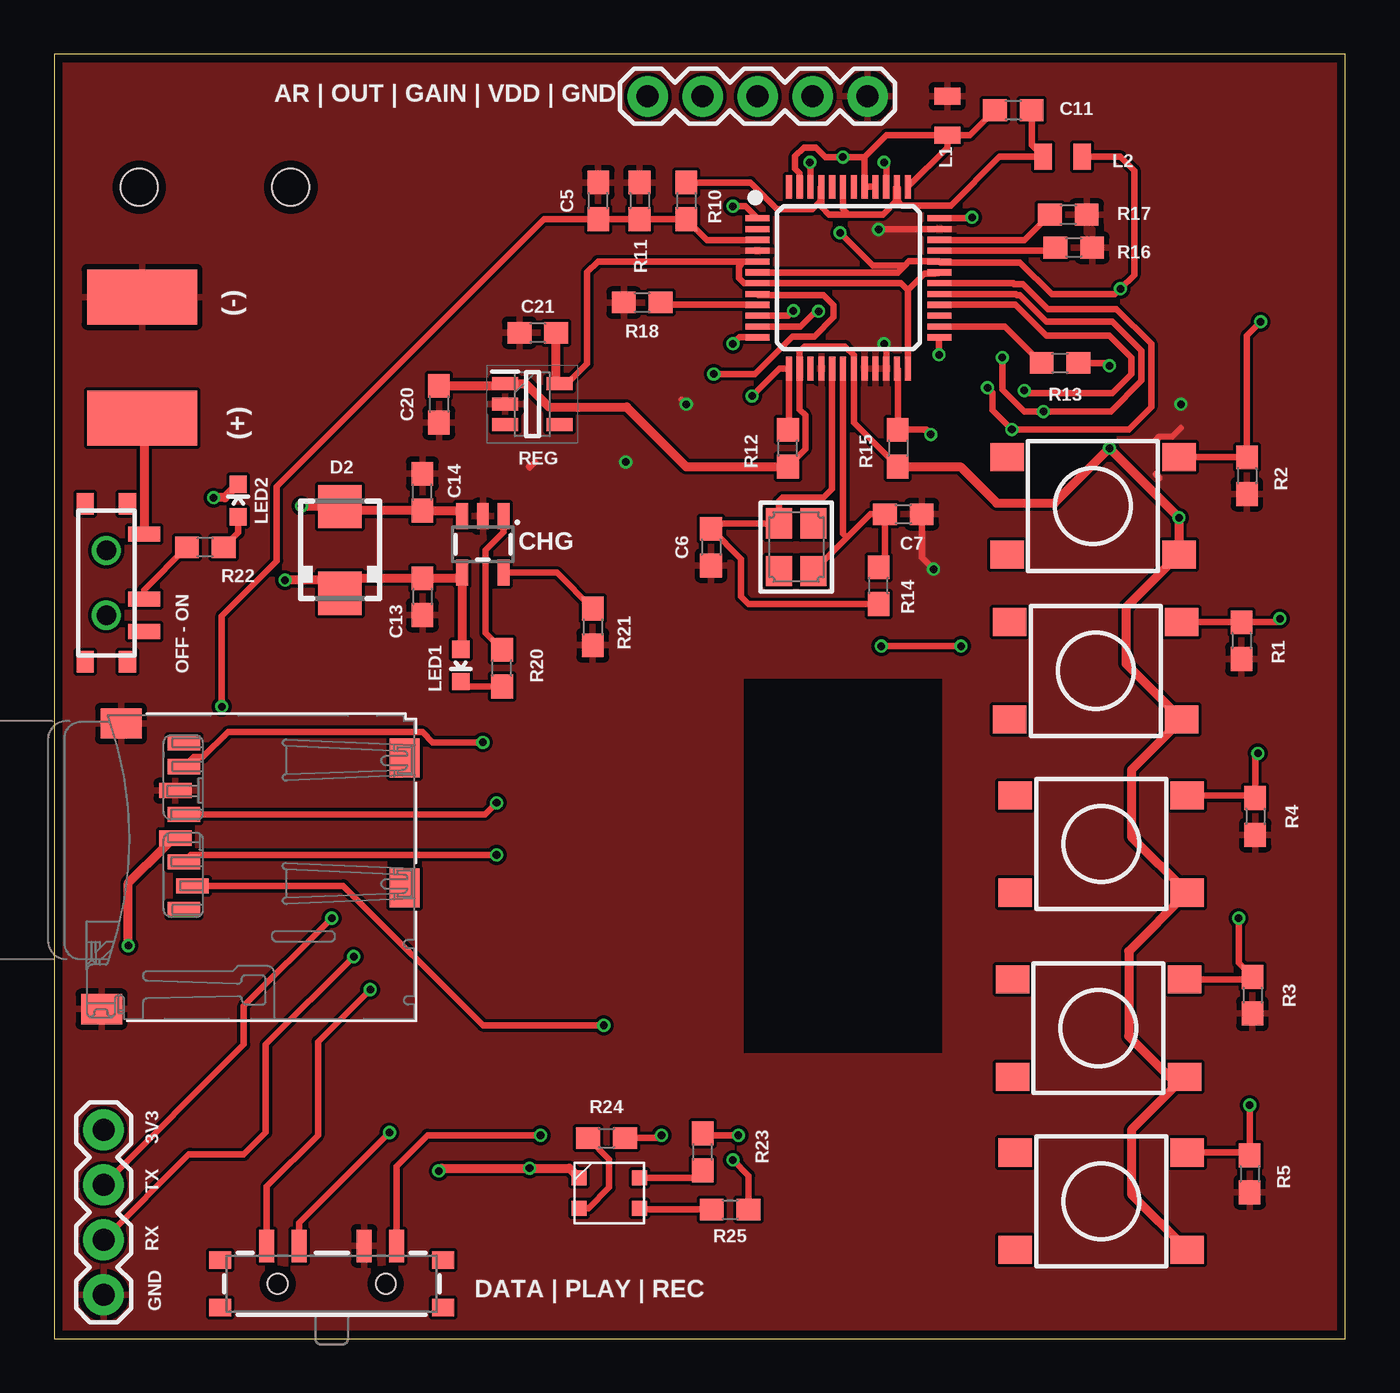
[diagram p8: board, top side]
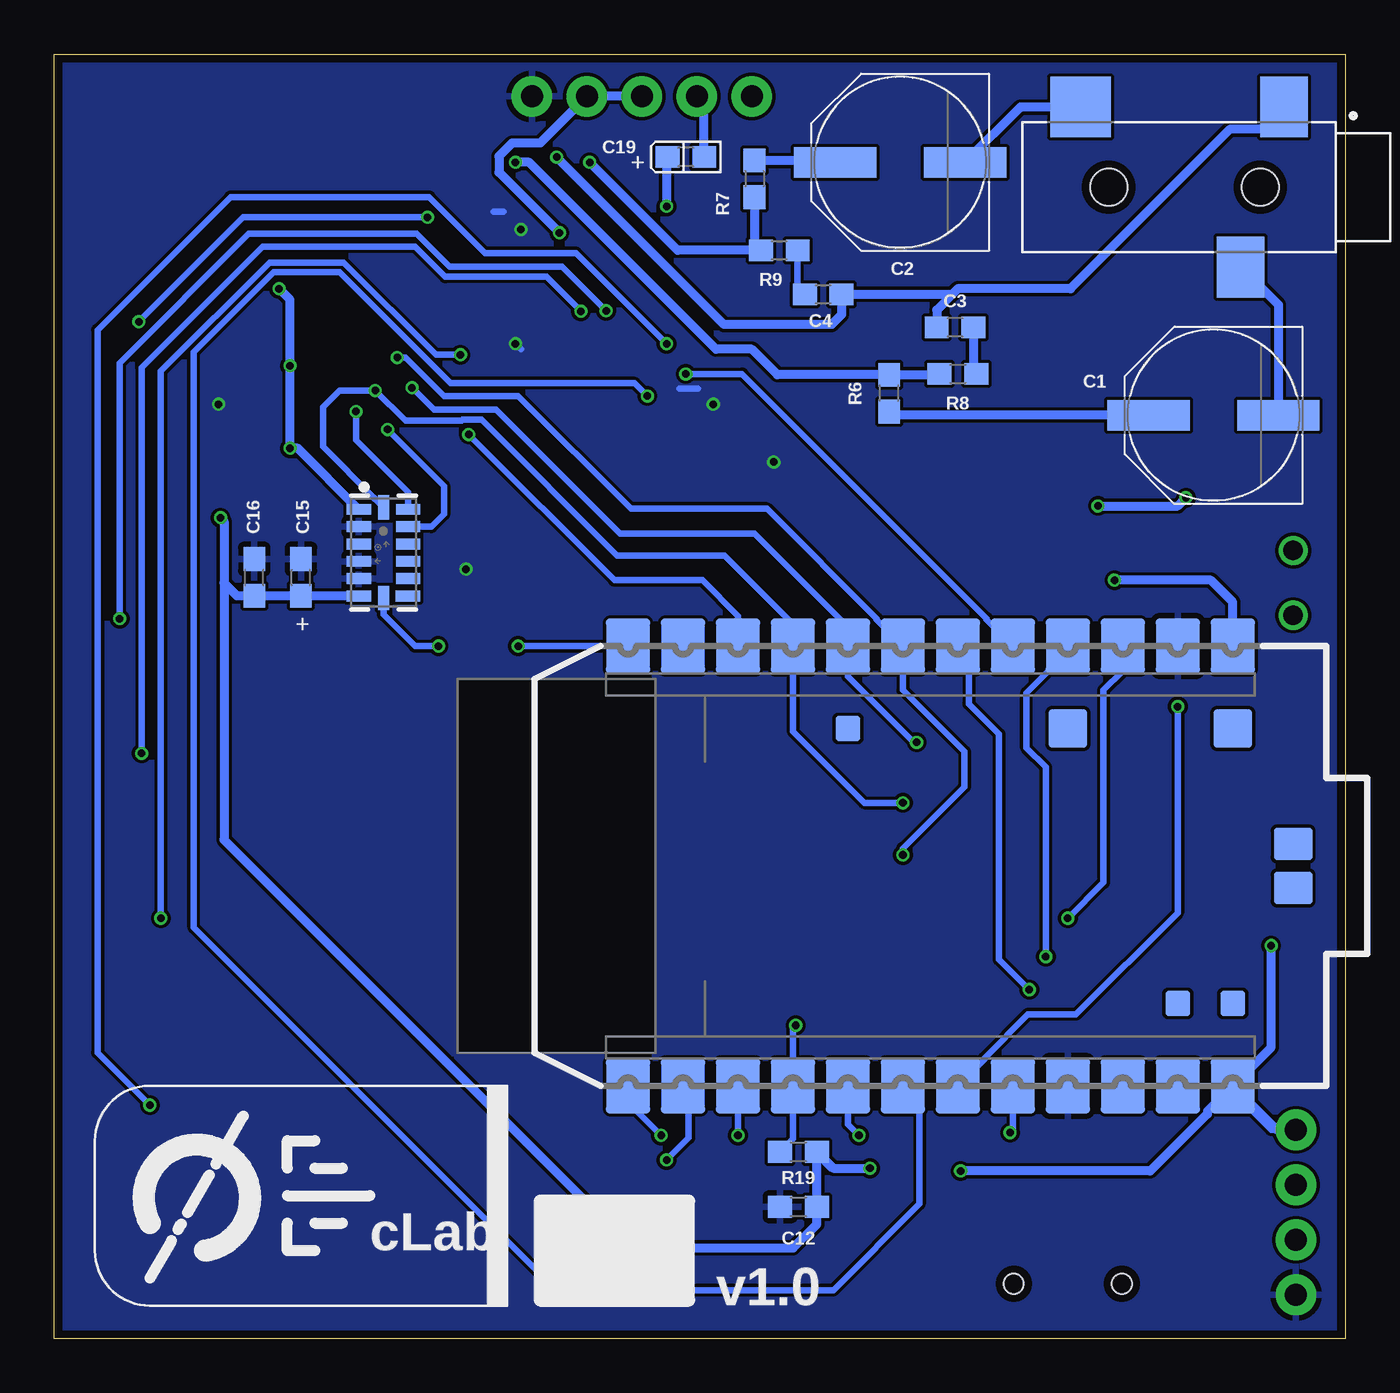
[diagram p9: board, bottom side, seen from below]

Size 59.67 x 59.36 mm. Coordinates in mm from the lower left corner, seen from the top.
Outline: 0,0 59.67,0 59.67,59.36 0,59.36 0,0
Copper layers (1*16): Top 0.035559375mm / dielectric 1.6mm / Bottom 0.035559375mm
Design rules "oshpark-2layer": minimum track width 6mil, minimum drill 10mil, track to track 6mil, track to pad 6mil, pad to pad 6mil, via to via 6mil, smd to smd 6mil, copper to edge 15mil, drill to drill 6mil, minimum pad ring 5mil, minimum via ring 5mil, stop-mask expansion 2.5mil, vias tented up to drill 0mil, thermal gap 10mil

### Footprints (pad centres in the part's own frame; a part is rotated, then mirrored left to right if it is on the bottom)
!_SJ-3523-SMT-TR_CUI_SJ-3523-SMT-TR = smd 2.2 x 2.8: 1 -1.1,-3.7; 3 0.9,3.7 | smd 2.8 x 2.8: 2 8.3,-3.7 | hole 1.7: 0,0; 7,0
!_TACTILE_SWITCH_SMD_6.2MM_TALL = smd 1.55 x 1.3: A1 -3.975,-2.25; A2 3.975,-2.25; B1 -3.975,2.25; B2 3.975,2.25
SMD2,54-5,08 = smd 2.54 x 5.08: 1 0,0
!_PANASONIC_E = smd 3.8 x 1.4: + 3,0; - -3,0
!_0603 = smd 1.1 x 1: 1 -0.85,0; 2 0.85,0
!_PARTICLE_PC0603 = smd 1.1 x 1: A 0.85,0; C -0.85,0
!_SOT23-5 = smd 1.2 x 0.55: 1 -1.3,0.95; 2 -1.3,0; 3 -1.3,-0.95; 4 1.3,-0.95; 5 1.3,0.95
!_MICROSD = smd 0.7 x 1.5: 1 9,-10.64; 2 7.9,-10.24; 3 6.8,-10.64; 4 5.7,-11.04; 5 4.6,-10.64; 6 3.5,-11.04; 7 2.4,-10.64; 8 1.3,-10.64 | smd 1.8 x 1.4: CD1 2,-0.44; CD2 8,-0.44 | smd 1.4 x 1.9: MT1 0.4,-13.54; MT2 13.6,-14.44
!_DIODE_SMA = smd 2 x 2: A 2,0; C -2,0
!_AP2127K-ADJTRG1_SOT95P282X145-5N = smd 1.2 x 0.6: 1 -1.25,0.95; 2 -1.25,0; 3 -1.25,-0.95; 4 1.25,-0.95; 5 1.25,0.95
!_CONNECTORS_1X05 = drill 1.016 pad 1.88: 1 0,0; 2 2.54,0; 3 5.08,0; 4 7.62,0; 5 10.16,0
!_CONNECTORS_1X04 = drill 1.016 pad 1.88: 1 0,0; 2 2.54,0; 3 5.08,0; 4 7.62,0
!_FERRITE_0805 = smd 0.8 x 1.2: 1 -0.9,0; 2 0.9,0
!_LED_0603 = smd 0.8 x 0.8: A -0.75,0; C 0.75,0
!_LED_3.2X2.8 = smd 0.7 x 0.7: P$1 -1.4,0.7; P$2 1.4,0.7; P$3 -1.4,-0.7; P$4 1.4,-0.7
!_SWITCH_PCM12SMTR = smd 0.7 x 1.5: O -2.25,1.75; P 0.75,1.75; S 2.25,1.75 | smd 1 x 0.8: P$1 -3.65,0.978; P$2 -3.65,-0.978; P$3 3.65,-0.978; P$4 3.65,0.978 | drill 0.9: P$5 -1.5,0; P$6 1.5,0
!SWITCH_SP3T_SMD = smd 0.7 x 1.5: 1 3,-1.75; 2 1.5,-1.75; 3 -1.5,-1.75; 4 -3,-1.75 | smd 1 x 0.8: P$1 -5.15,-1.1; P$2 -5.15,1.1; P$3 5.15,1.1; P$4 5.15,-1.1 | hole 0.9: 2.5,0; -2.5,0
!VS1053_LQFP48 = smd 1.1 x 0.285: 1 -4.2,2.75; 2 -4.2,2.25; 3 -4.2,1.75; 4 -4.2,1.25; 5 -4.2,0.75; 6 -4.2,0.25; 7 -4.2,-0.25; 8 -4.2,-0.75; 9 -4.2,-1.25; 10 -4.2,-1.75; 11 -4.2,-2.25; 12 -4.2,-2.75; 25 4.2,-2.75; 26 4.2,-2.25; 27 4.2,-1.75; 28 4.2,-1.25; 29 4.2,-0.75; 30 4.2,-0.25; 31 4.2,0.25; 32 4.2,0.75; 33 4.2,1.25; 34 4.2,1.75; 35 4.2,2.25; 36 4.2,2.75 | smd 0.285 x 1.1: 13 -2.75,-4.2; 14 -2.25,-4.2; 15 -1.75,-4.2; 16 -1.25,-4.2; 17 -0.75,-4.2; 18 -0.25,-4.2; 19 0.25,-4.2; 20 0.75,-4.2; 21 1.25,-4.2; 22 1.75,-4.2; 23 2.25,-4.2; 24 2.75,-4.2; 37 2.75,4.2; 38 2.25,4.2; 39 1.75,4.2; 40 1.25,4.2; 41 0.75,4.2; 42 0.25,4.2; 43 -0.25,4.2; 44 -0.75,4.2; 45 -1.25,4.2; 46 -1.75,4.2; 47 -2.25,4.2 | smd 0.28 x 1.1: 48 -2.75,4.2
!_ADXL345_LGA-14 = smd 0.5 x 1.124: 1 2,1.138; 2 1.2,1.138; 3 0.4,1.138; 4 -0.4,1.138; 5 -1.2,1.138; 6 -2,1.138; 8 -2,-1.13; 9 -1.2,-1.138; 10 -0.4,-1.138; 11 0.4,-1.138; 12 1.2,-1.138; 13 2,-1.138 | smd 1.124 x 0.5: 7 -2.1,0; 14 2.1,0
!_PARTICLE-DEVICES_PHOTON_SMD = smd 2.54 x 2.032: 1 0,33.02; 2 0,30.48; 3 0,27.94; 4 0,25.4; 5 0,22.86; 6 0,20.32; 7 0,17.78; 8 0,15.24; 9 0,12.7; 10 0,10.16; 11 0,7.62; 12 0,5.08; 13 20.32,5.08; 14 20.32,7.62; 15 20.32,10.16; 16 20.32,12.7; 17 20.32,15.24; 18 20.32,17.78; 19 20.32,20.32; 20 20.32,22.86; 21 20.32,25.4; 22 20.32,27.94; 23 20.32,30.48; 24 20.32,33.02 | smd 1.778 x 1.778: 25 3.81,33.02; 26 3.81,25.4 | smd 1.143 x 1.143: 27 3.81,15.24; 28 16.51,30.48; 29 16.51,33.02 | smd 1.524 x 1.778: 30 11.176,35.814; 31 9.144,35.814
!_CRYSTAL_3.2X2.5 = smd 1.4 x 1.2: 1 -1.1,-0.8; 2 1.1,0.8; GND1 -1.1,0.8; GND2 1.1,-0.8

### Placement (x,y rotation side)
AUXCONN  3.94,53.21 180 bottom
B1  48.13,30.86 0 top
B2  48.01,38.48 0 top
B3  48.26,14.35 0 top
B4  48.39,22.86 0 top
B5  48.39,6.35 0 top
BATNEG  4.06,48.13 90 top
BATPOS  4.06,42.55 90 top
C1  6.1,42.67 180 bottom
C2  20.57,54.36 180 bottom
C3  18.03,46.74 180 bottom
C4  24.13,48.26 0 bottom
C5  25.15,52.58 90 top
C6  30.35,36.58 270 top
C7  39.24,38.1 0 top
C11  44.32,56.77 180 top
C12  25.27,6.1 180 bottom
C13  17.02,34.29 270 top
C14  17.02,39.12 90 top
C15  48.26,35.18 90 bottom
C16  50.42,35.18 90 bottom
C19  30.48,54.61 180 bottom
C20  17.78,43.18 270 top
C21  22.35,46.48 180 top
CHG  19.81,36.7 270 top
CN1  16.64,28.83 270 top
D2  13.21,36.45 90 top
IC1  22.1,43.18 0 top
J1  37.59,57.4 180 top
J2  2.29,2.03 90 top
L1  41.27,56.52 270 top
L2  46.61,54.61 180 top
LED1  18.8,31.11 270 top
LED2  8.51,38.73 90 top
LED3  25.65,6.73 0 top
R1  54.86,32.26 270 top
R2  55.12,39.88 270 top
R3  55.37,15.88 270 top
R4  55.5,24.13 270 top
R5  55.24,7.62 270 top
R6  21.08,43.69 90 bottom
R7  27.3,53.59 270 bottom
R8  17.91,44.58 0 bottom
R9  26.16,50.29 0 bottom
R10  29.21,52.58 270 top
R11  27.05,52.58 270 top
R12  33.91,41.15 90 top
R13  46.48,45.08 180 top
R14  38.1,34.8 90 top
R15  38.99,41.15 270 top
R16  47.12,50.42 0 top
R17  46.86,51.94 0 top
R18  27.18,47.88 180 top
R19  25.27,8.64 180 bottom
R20  20.7,30.99 90 top
R21  24.89,32.89 270 top
R22  6.99,36.58 180 top
R23  29.97,8.64 90 top
R24  25.53,9.27 0 top
R25  31.24,5.97 0 top
SLIDE_ON  2.41,34.92 270 top
SWITCH  12.83,2.54 180 top
U1  36.7,49.02 0 top
U2  44.45,36.32 90 bottom
U$1  38.23,32 270 bottom
Y1  34.29,36.58 270 top

### Tracks (layer width: path | path; a pad name or v marks a point on that pad's centre or on a via)
1.8V
  Top 0.305: 39.45,48.45 40.23,49.22 40.7,49.22 40.71,49.23 40.86,49.23 U1.31 | 39.45,48.45 U1.24 | U1.5 31.75,49.77 | 31.75,49.77 25.13,49.77 24.64,49.28 24.64,45.05 23.71,44.13 IC1.5 23.2,44.28 | 31.75,49.77 31.75,49.64 31.65,49.54 31.65,49 31.88,48.77 U1.7 39.13,48.77 39.45,48.45
  Top 0.406: 23.2,44.28 C21.1
3.3V  (via drill 0.35)
  Top 0.305: U1.6 38.98,49.27 39.31,49.59 | 39.31,49.59 39.5,49.78 40.89,49.78 U1.32 40.95,49.73 44.63,49.73 46.1,48.26 49.02,48.26 v49.28,48.51 49.91,49.15 49.91,53.97 49.28,54.61 L2.1 | R12.1 34.71,41.1 34.71,42.67 34.45,42.94 U1.14 34.45,45.63 34.67,45.85 36.55,45.85 36.95,45.45 U1.19 36.95,42.33 R15.2 | 39.31,49.59 37.83,49.59 v36.32,51.1 | 5.1,22.73 5.2,22.73 CN1.4 | v48.77,44.96 48.64,45.08 R13.1
  Top 0.406: v17.78,7.75 17.91,7.87 v21.97,7.87 23.81,7.87 LED3.P$1 | v3.43,18.16 3.43,21.06 5.1,22.73 | C20.1 20.75,44.03 IC1.1 21.78,44.13 22.86,43.05 26.45,43.05 29.21,40.3 R12.1 | R15.2 41.87,40.3 43.56,38.61 46.23,38.61 v48.77,41.15 v51.98,37.94 B2.A2 49.53,33.78 49.53,31.19 B1.A2 49.78,26.29 49.78,23.19 B4.A2 49.66,17.91 49.66,13.97 51.53,12.1 B3.A2 49.78,9.65 49.78,6.68 B5.A2
  Bottom 0.305: R19.1 24.42,8.51 | 24.42,8.51 C12.1 | U$1.24 5.33,11.56 | 5.33,11.56 6.43,10.46 6.43,10.41 9.09,7.75 v17.78,7.75 | v21.97,7.87 23.79,7.87 24.42,8.51 | J2.4 3.43,9.65 5.33,11.56
  Bottom 0.406: J1.3 J1.2 37.21,55.25 38.5,55.25 39.11,54.64 39.11,53.89 v36.32,51.1 | v49.28,48.51 48.77,48.01 v48.77,44.96 v48.77,41.15 48.41,41.15 U2.1 | 51.82,34.92 51.82,37.77 v51.98,37.94 | 51.82,34.92 51.82,23.05 32.96,4.19 25.53,4.19 24.42,5.3 C12.1 R19.1 23.66,7.87 v21.97,7.87 | J2.4 3.17,9.65 U$1.24 | U$1.24 6.38,10.52 6.38,10.39 9.01,7.75 v17.78,7.75 | U$1.24 3.43,13.46 v3.43,18.16 | U2.6 C15.1 C16.1 51.22,34.33 51.82,34.92
ADXL_CS  (via drill 0.35)
  Top 0.305: v41.91,32 v38.23,32
  Bottom 0.305: v41.91,32 42.98,32 42.99,32 44.45,33.46 U2.7 | v38.23,32 U$1.12
AGND  (via drill 0.35)
  Top 0.305: L1.2 41.27,55.04 U1.37 | U1.40 U1.41 37.45,54.6 | L1.2 42.32,55.61 C11.2 | L1.2 38.47,55.61 37.45,54.6 | U1.47 34.45,53.86 34.24,54.07 34.24,54.64 34.64,55.04 35.21,55.04 35.65,54.6 v36.45,54.6 37.45,54.6
  Bottom 0.406: AUXCONN.1 3.87,55.88 5.33,55.88 12.7,48.51 17.91,48.51 18.16,48.26 | C3.2 18.88,47.54 18.16,48.26 | 18.16,48.26 C4.2 23.28,47.33 23.75,46.86 28.71,46.86 v36.45,54.6
AVDD
  Top 0.305: 36.7,51.94 38.3,51.94 38.91,52.56 38.91,53.18 U1.38 39,53.18 39,52.56 39.18,52.37 41.45,52.37 43.69,54.61 L2.2 45.17,55.15 C11.1 | 36.7,51.94 36.45,52.19 U1.43 | 36.7,51.94 35.81,51.94 35.45,52.3 U1.45 35.41,53.18 35.41,52.56 35.05,52.2 33.4,52.2 32.17,53.43 R10.1
BAT  (via drill 0.35)
  Top 0.305: 13.39,38.27 D2.A | 11.46,38.45 v11.43,38.48
  Top 0.406: LED2.C 7.89,38.86 v7.37,38.86 | CHG.3 18.6,38.27 C14.1 13.39,38.27 | D2.A 11.46,38.45
  Bottom 0.406: v11.43,38.48 7.75,38.48 v7.37,38.86
BAT+
  Top 0.406: BATPOS.1 4.16,42.45 SLIDE_ON.O
CS_3V  (via drill 0.35)
  Top 0.305: v40.51,41.78 40.3,42 R15.1 38.99,44.79 U1.23
  Bottom 0.305: v40.51,41.78 33.78,35.05 29.72,35.05 28.07,33.4 U$1.10
DREQ  (via drill 0.35)
  Top 0.305: U1.8 32.55,48.23 35.54,48.23 36.01,47.76 36.01,47.19 35.13,46.31 34.12,46.31 32.38,44.58 v30.48,44.58
  Bottom 0.305: U$1.5 16.59,33.22 16.59,33.28 27.88,44.58 v30.48,44.58
GND  (via drill 0.35)
  Top 0.305: 29,43.39 v29.21,43.18 | 22.23,40.51 21.97,40.26 21.94,40.29 | 51.08,39.78 50.9,39.95 | 50.9,41.51 51.08,41.69 51.68,41.69 52.07,42.08 | U1.35 38.11,51.27 v38.1,51.26 | v40.64,35.56 40.09,36.11 C7.2 | U1.22 38.45,45.88 v38.35,45.97
  Bottom 0.305: 26.54,40.51 v26.42,40.51 | 38.91,52.07 39.37,52.07 | 40.77,35.69 v40.64,35.56 | v38.35,45.97 38.1,45.72 | 30.76,43.89 29.92,43.89
  other vias: 52.07,43.18
  pour Top: -5.08,66.04 71.12,66.04 71.12,-7.62 -5.08,-7.62
  pour Bottom: -7.62,67.31 -7.62,-11.43 74.93,-11.43 74.93,68.58 72.39,68.58 -7.62,68.58
GPIO0
  Top 0.305: U1.33 46.12,50.27 R16.1
GPIO1
  Top 0.305: U1.34 44.84,50.77 R17.1
GPIO2
  Top 0.305: U1.9 28.14,47.77 R18.1
GPIO3  (via drill 0.35)
  Top 0.305: U1.10 33.94,47.27 v34.16,47.5 | v56.64,33.27 56.48,33.11 R1.1 B1.B2
  Bottom 0.305: v34.16,47.5 36.2,49.53 41.4,49.53 42.93,51.05 50.67,51.05 56.64,45.08 v56.64,33.27
GPIO4  (via drill 0.35)
  Top 0.305: U1.36 42.37,51.77 v42.42,51.82 | B2.B2 R2.1 55.12,46.36 v55.75,46.99
  Bottom 0.305: v42.42,51.82 50.93,51.82 v55.75,46.99
GPIO5  (via drill 0.35)
  Top 0.305: B3.B2 55.25,16.6 R3.1 54.74,17.36 v54.74,19.43 | v40.89,45.47 U1.25
  Bottom 0.305: v40.89,45.47 42.02,45.47 46.29,49.73 49.72,49.73 54.74,44.72 v54.74,19.43
GPIO6  (via drill 0.35)
  Top 0.305: U1.11 34.49,46.77 35.2,47.48 v35.33,47.48 | v55.63,27.05 55.5,26.92 R4.1 55.37,25.11 B4.B2
  Bottom 0.305: v35.33,47.48 36.92,49.07 41.59,49.07 42.99,50.47 50.04,50.47 55.63,44.88 v55.63,27.05
GPIO7  (via drill 0.35)
  Top 0.305: B5.B2 55.12,8.6 R5.1 v55.24,10.8 | U1.12 31.67,46.27 v31.37,45.97
  Bottom 0.305: v31.37,45.97 35.56,50.17 39.75,50.17 42.34,52.75 51.51,52.75 57.66,46.61 57.66,13.21 v55.24,10.8
L_OUT
  Bottom 0.305: 17.55,54.38 C2.-
  Bottom 0.406: AUXCONN.2 15.02,56.91 17.55,54.38
LED_B  (via drill 0.35)
  Top 0.305: R23.2 30.06,9.4 v31.62,9.4
  Bottom 0.305: U$1.13 33.15,10.92 v31.62,9.4
LED_G  (via drill 0.35)
  Top 0.305: R25.2 32.09,7.53 v31.37,8.26
  Bottom 0.305: U$1.14 30.35,11.43 30.35,9.27 v31.37,8.26
LED_R  (via drill 0.35)
  Top 0.305: R24.2 27.94,9.27 v28.07,9.4
  Bottom 0.305: U$1.15 v28.07,9.4
LEFT  (via drill 0.35)
  Top 0.305: U1.46 34.95,54.33 v34.92,54.36
  Bottom 0.406: R7.2 27.3,50.58 R9.1 30.86,50.29 v34.92,54.36
LEFT_FILTERED
  Bottom 0.406: C2.+ 23.66,54.44 R7.1
MIC_P  (via drill 0.35)
  Top 0.305: U1.1 31.95,52.32 v31.37,52.32
  Bottom 0.406: C19.A 31.37,54.57 v31.37,52.32
MISO  (via drill 0.35)
  Top 0.305: U1.30 44.32,48.77 44.36,48.73 44.77,48.73 45.92,47.57 49.1,47.57 50.7,45.97 50.7,43.05 49.66,42.01 v44.26,42.01 43.36,42.91 43.36,43.72 v43.13,43.94 | v19.81,27.56 17.5,27.56 17.02,28.03 8.03,28.03 6.87,26.87 6.44,26.87 CN1.7
  Bottom 0.305: v43.13,43.94 42.12,42.93 39.24,42.93 33.53,37.21 27.3,37.21 22.99,32.89 U$1.8 22.99,30.61 19.81,27.43 v19.81,27.56 | v44.26,42.01 41.66,39.41 41.66,38.1 42.23,37.52 U2.12
MOSI_3V  (via drill 0.35)
  Top 0.305: U1.29 44.45,48.27 44.49,48.23 44.62,48.23 45.86,46.99 48.91,46.99 50.24,45.66 50.24,44.26 48.83,42.85 v45.72,42.85 44.83,42.85 43.81,43.86 v43.81,45.34 | v20.45,22.35 6.32,22.35 CN1.3
  Bottom 0.305: v20.45,22.35 20.45,22.66 17.61,25.5 17.61,27.13 20.45,29.97 U$1.7 21.67,33.22 21.67,33.28 26.74,38.35 33.02,38.35 38.23,43.56 41.66,43.56 43.43,45.34 v43.81,45.34 | v45.72,42.85 45.72,41.52 43.31,39.12 U2.13
N$1
  Top 0.305: U1.17 35.95,39.25 35.56,38.86 33.66,38.86 33.49,38.7 Y1.1 30.6,37.68 C6.1 31.75,36.03 31.75,34.29 32.09,33.95 R14.1
N$2
  Top 0.305: Y1.2 36.64,37.02 | 36.64,37.02 37.71,38.1 C7.1 38.39,35.94 R14.2 | U1.18 36.45,37.21 36.64,37.02
N$3
  Top 0.305: CHG.1 20.76,37.27 19.94,36.45 19.94,32.6 R20.2
N$4
  Top 0.305: R20.1 19.02,30.14 LED1.C
N$5
  Bottom 0.305: C4.1 25.31,48.59 R9.2
N$6
  Bottom 0.406: C3.1 17.18,44.7 R8.2
N$8
  Top 0.305: R22.2 4.16,34.6 SLIDE_ON.P
N$9
  Top 0.305: R22.1 8.51,37.25 LED2.A
N$11
  Top 0.305: LED3.P$2 29.62,7.43 R23.1
N$12
  Top 0.305: LED3.P$3 24.7,6.03 25.65,6.98 25.65,8.29 R24.1
N$13
  Top 0.305: R25.1 27.12,5.97 LED3.P$4
N$21
  Top 0.305: CHG.5 23.23,35.4 R21.1
OUT
  Bottom 0.406: C19.C 29.63,57.06 J1.4
PVIN  (via drill 0.35)
  Top 0.305: LED1.A 18.8,35.34 CHG.4 | 13.9,35.14 13.26,34.5 | 13.26,34.5 D2.C | v10.67,35.05 12.7,35.05 13.26,34.5
  Top 0.406: v10.67,35.05 12.61,35.05 D2.C 13.9,35.14 C13.1 18.6,35.14 18.8,35.34 | CHG.4 18.86,31.93 LED1.A
  Bottom 0.406: U$1.1 5.21,34.04 6.22,35.05 v10.67,35.05
R_OUT
  Bottom 0.406: AUXCONN.3 3.1,47.77 C1.-
RIGHT  (via drill 0.35)
  Top 0.305: U1.39 38.45,54.26 v38.35,54.36
  Bottom 0.406: R8.1 18.8,44.54 R6.2 26.25,44.54 27.43,45.72 29.08,45.72 37.72,54.36 v38.35,54.36
RIGHT_FILTERED
  Bottom 0.406: C1.+ 20.92,42.67 R6.1
RST_3V  (via drill 0.35)
  Top 0.305: U1.3 30.17,50.77 R10.2 R11.2 C5.1 22.64,51.73 10.29,39.37 10.29,35.94 7.75,33.4 v7.75,29.21
  Bottom 0.305: U$1.19 16.69,12.9 16.69,12.96 14.66,14.99 12.45,14.99 7.75,19.69 v7.75,29.21
RX  (via drill 0.35)
  Top 0.305: v13.84,17.65 9.78,13.59 9.78,9.52 8.76,8.51 6.35,8.51 6.22,8.51 J2.2
  Bottom 0.305: U$1.4 12.83,31.75 14.73,29.84 14.73,27.3 13.84,26.42 v13.84,17.65
RX_VS1053
  Top 0.305: U1.26 43.95,46.77 R13.2
SCLK_3V  (via drill 0.35)
  Top 0.305: U1.28 44.43,47.77 45.85,46.36 48.77,46.36 49.78,45.34 49.78,44.58 48.9,43.69 44.96,43.69 v44.83,43.81 | v20.45,24.77 19.91,24.23 CN1.5
  Bottom 0.305: v20.45,24.77 22.23,24.77 25.53,28.07 U$1.9 25.53,32.51 25.27,32.77 28.7,36.19 33.66,36.19 39.93,42.47 40.8,42.47 40.84,42.42 43.43,42.42 v44.83,43.81 46.48,43.81 47.24,43.05 47.24,41.22 44.91,38.88 44.9,38.88 44.72,38.7 44.72,38.69 U2.14
SDCS_3V  (via drill 0.35)
  Top 0.305: CN1.2 13.36,20.93 19.81,14.48 v25.4,14.48
  Bottom 0.305: R19.2 25.53,9.23 U$1.16 25.53,14.35 v25.4,14.48
SP3DATA  (via drill 0.35)
  Top 0.305: v14.61,16.13 12.19,13.72 12.19,9.4 9.83,7.03 SWITCH.1
  Bottom 0.305: U$1.6 17.4,31.5 17.4,29.34 16,27.94 16,17.53 v14.61,16.13
SP3PLAY  (via drill 0.35)
  Top 0.305: v15.49,9.52 11.33,5.36 SWITCH.2
  Bottom 0.305: U$1.20 15.37,9.65 v15.49,9.52
SP3REC  (via drill 0.35)
  Top 0.305: SWITCH.4 15.83,7.97 17.25,9.4 v22.48,9.4
  Bottom 0.305: U$1.17 22.99,9.91 v22.48,9.4
TX  (via drill 0.35)
  Top 0.305: v12.83,19.43 8.76,15.37 8.76,13.59 J2.3
  Bottom 0.305: U$1.3 10.29,30.86 11.18,29.97 11.18,21.08 v12.83,19.43
XDCS_3V  (via drill 0.35)
  Top 0.305: v32.26,43.56 33.52,44.82 U1.13 33.95,42.04 R12.2
  Bottom 0.305: U$1.18 19.68,10.92 19.68,6.22 23.66,2.24 36.46,2.24 53.21,18.99 53.21,45.59 49.53,49.28 46.48,49.28 41.35,44.14 32.84,44.14 v32.26,43.56

### Text on the board
bPlace: cLab | v1.0
tNames: AR | OUT | GAIN | VDD | GND | (-) | (+) | REG | OFF - ON | 3V3 | TX | RX | DATA | PLAY | REC | GND
bNames: + | +